# EasyEDA Pro project 电池内阻仪.eprj, board PCB5
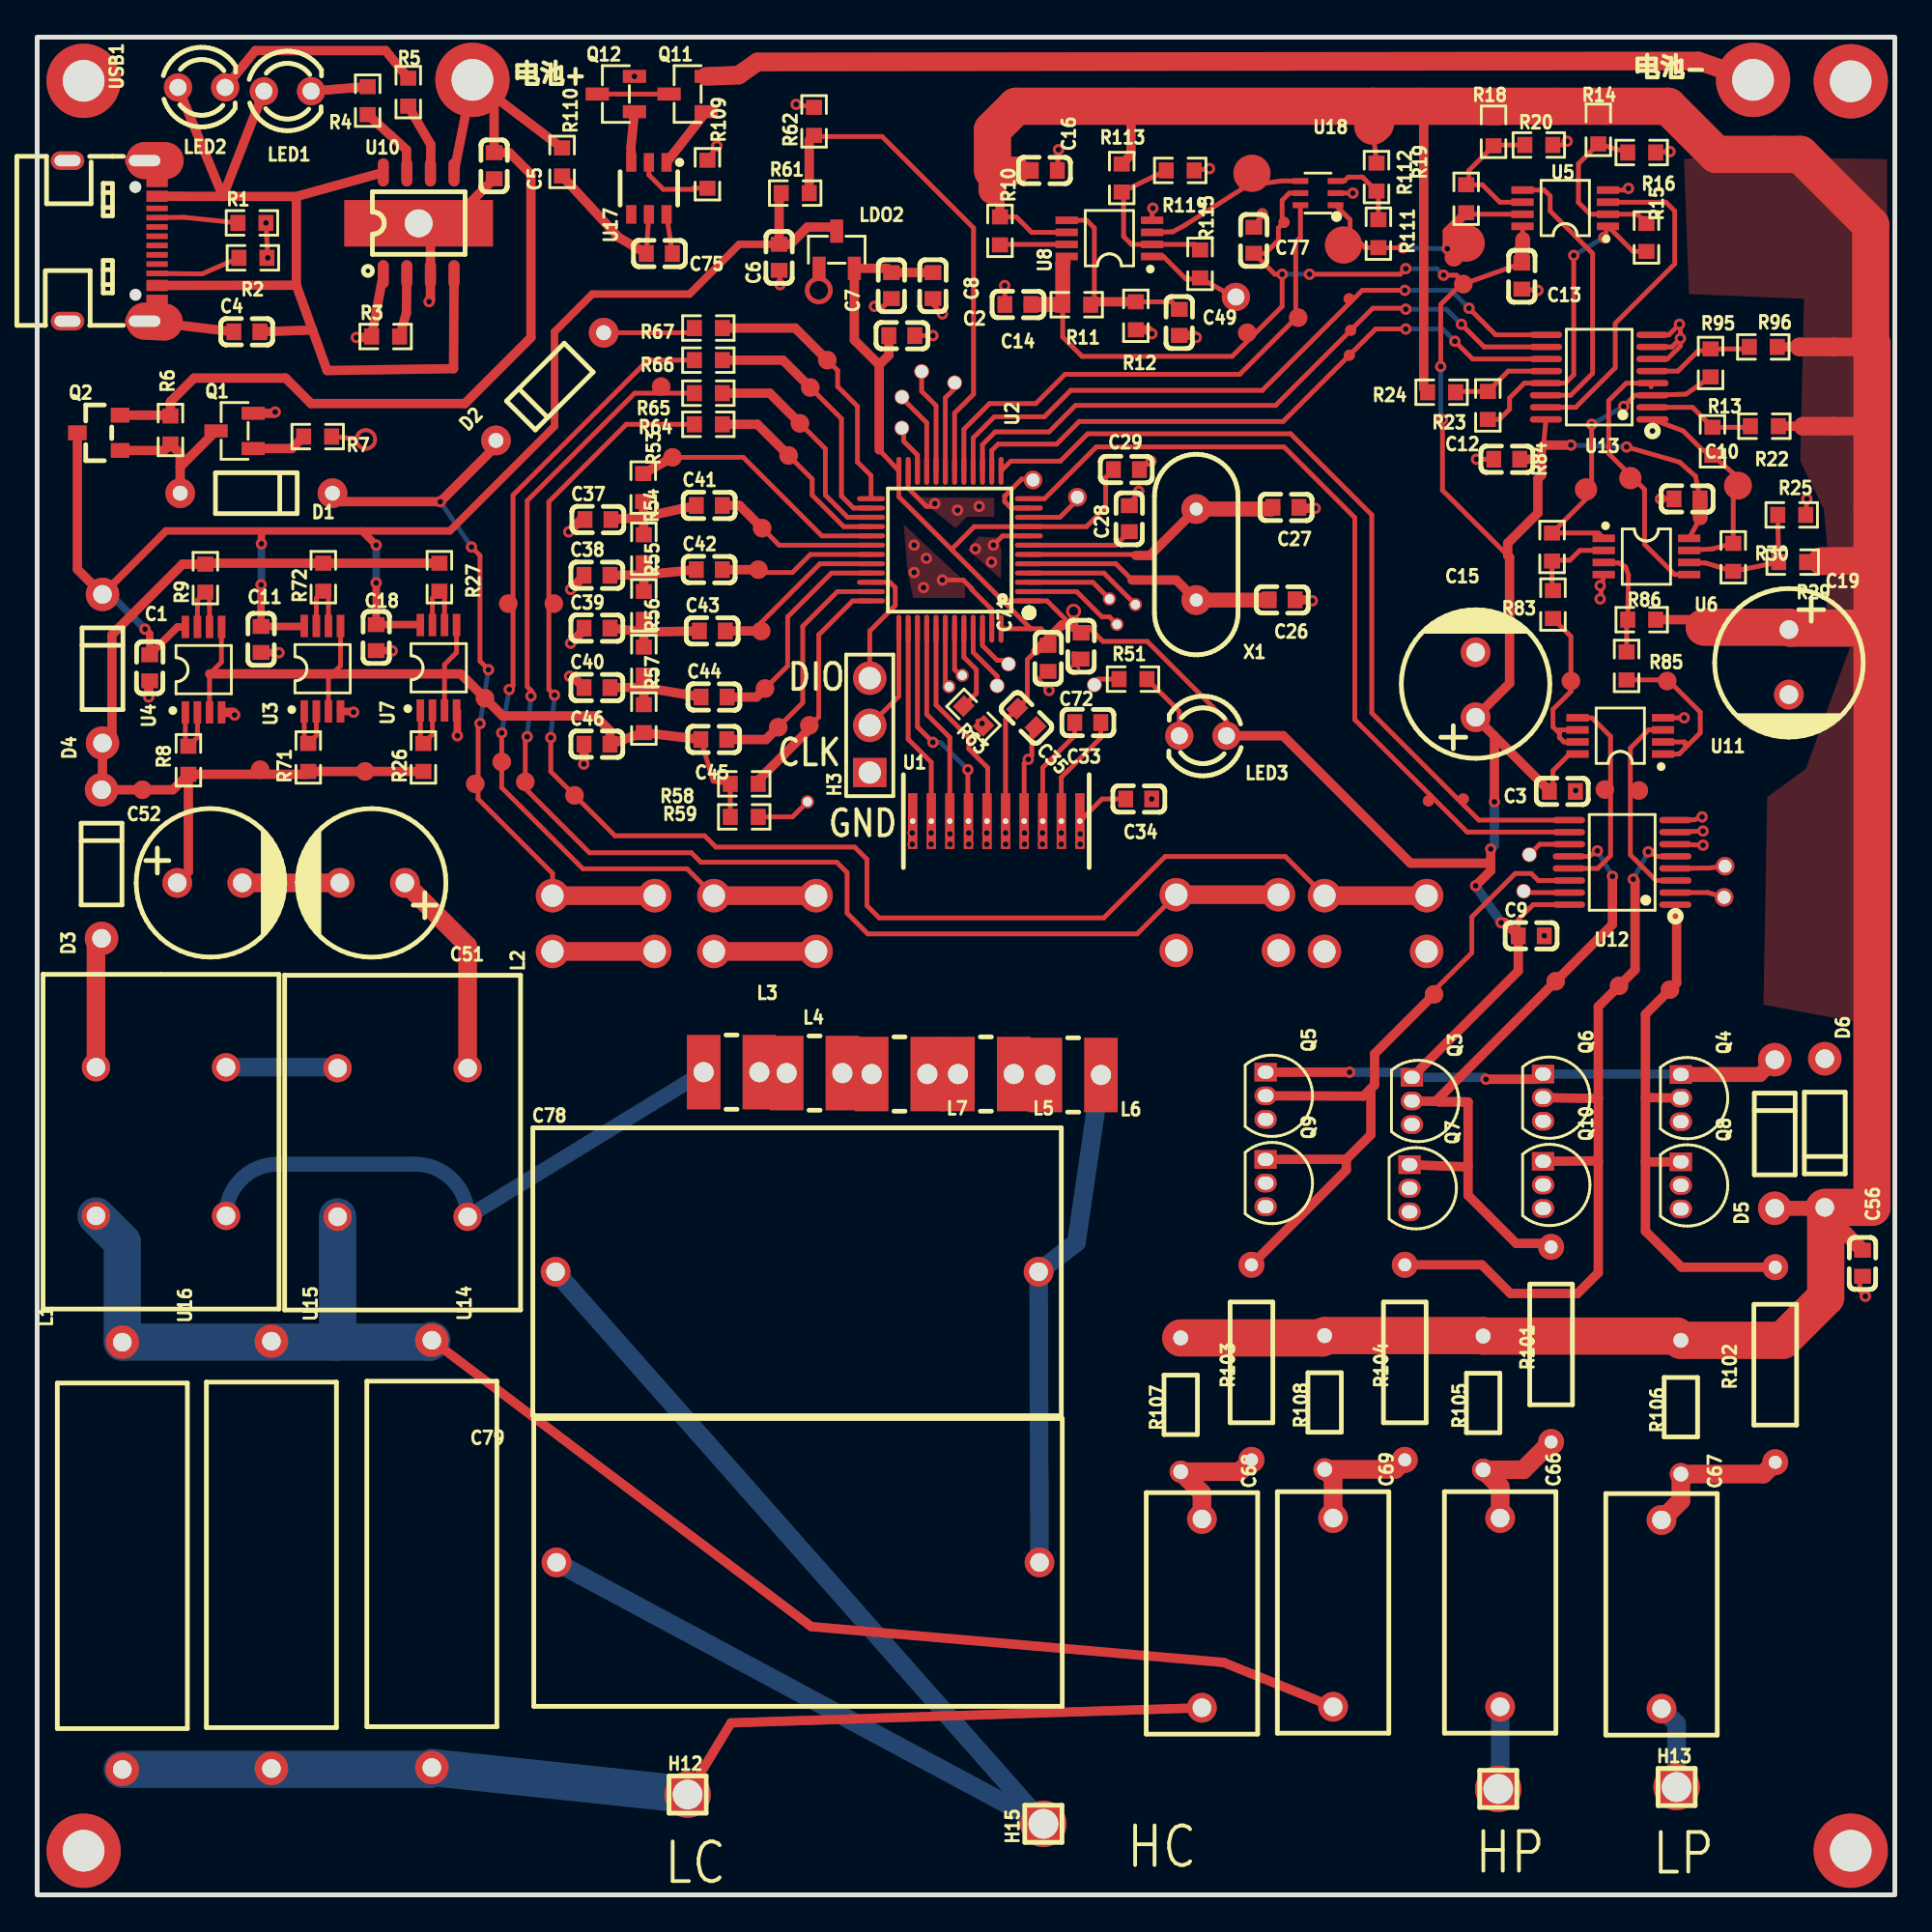
[diagram p1: board, top side]
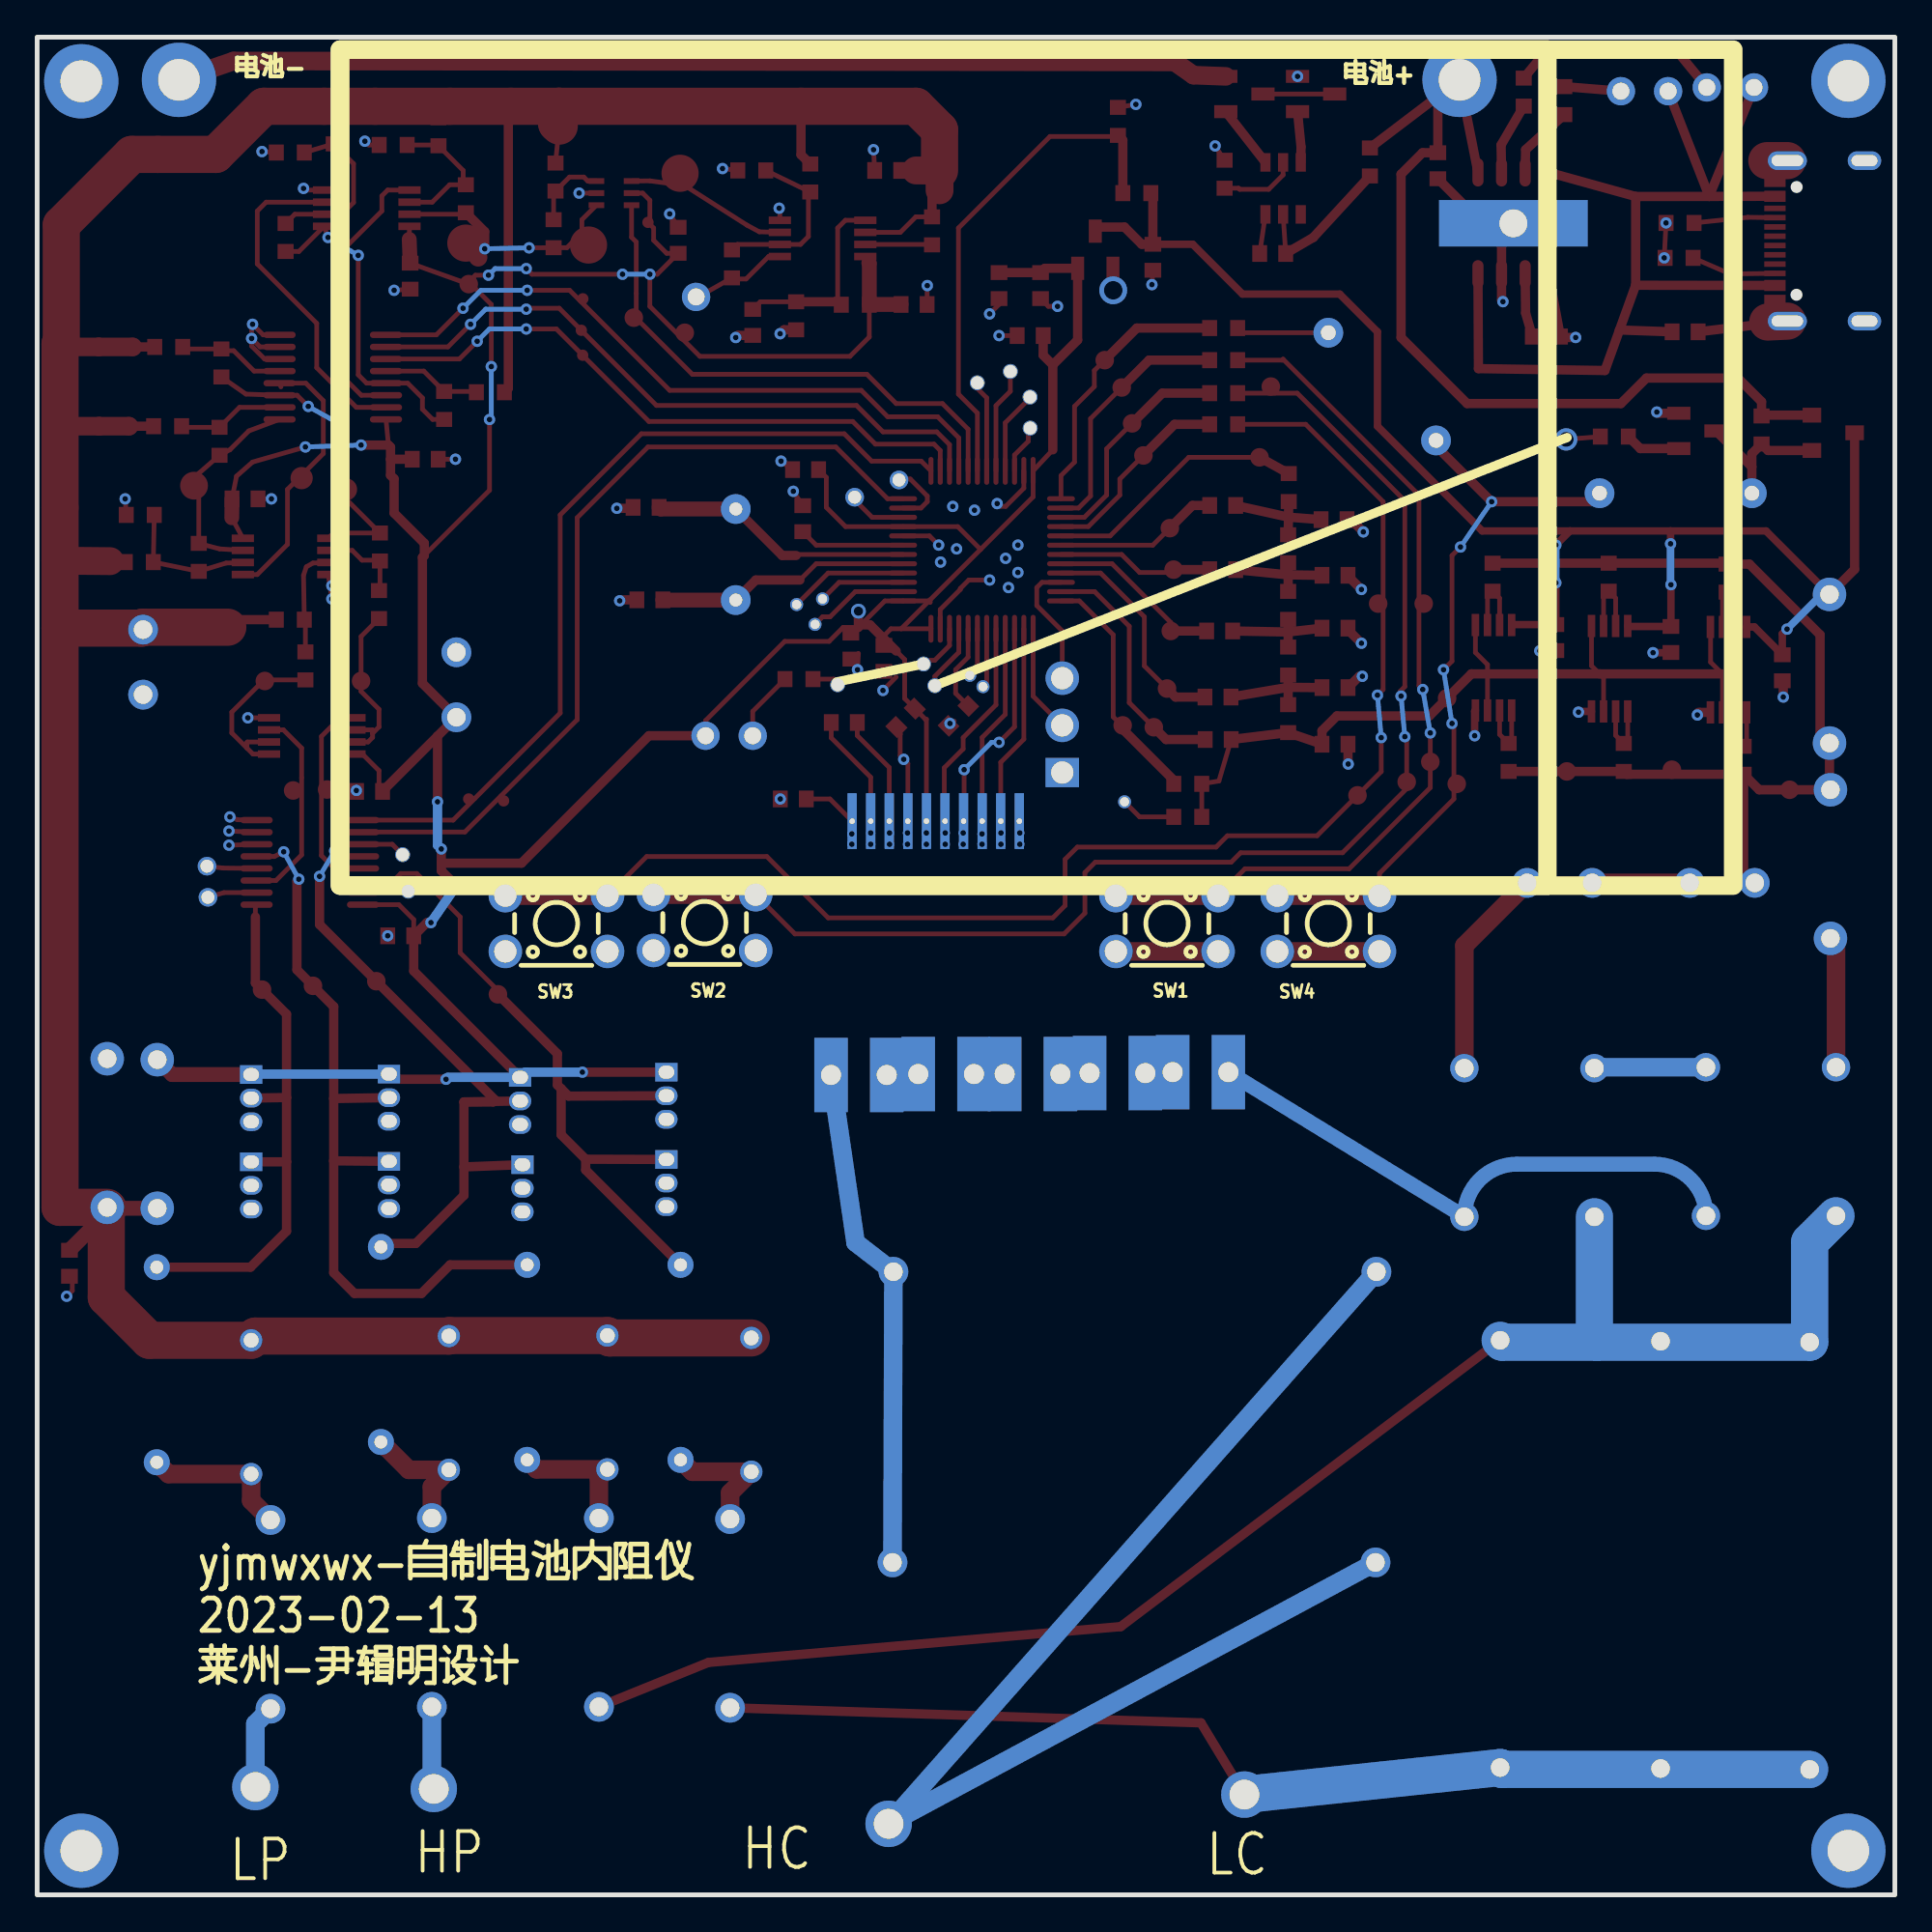
[diagram p2: board, bottom side, seen from below]

Outline 100 x 100 mm; copper layers: Top Layer, Bottom Layer. Coordinates in mm from the lower left corner of the outline.
Outline path: rectangle 0,100 100,0
Stack: Top Layer 0.035mm / Dielectric1 1.51mm FR4 er 4.5 / Bottom Layer 0.035mm

## Design rules (mm)
spacing safeClearance (default): track to track 0.152, other pairs 0.152 to 0.3
track width trackWidth (default): min 0.127, default 0.254, max 2.54
differential pair differentialPair (default): width min 0.127, default 0.254, max 2.54; gap min 0.152, default 0.152
via viaSize (default): diameter min 0.5, default 0.61, max 10; hole min 0.3, default 0.305, max 6

## Placement (name value [footprint] x y rotation side)
C1  100nF  [C0603]  6.06 66.05 270 top
C2  10uF  [C0603]  46.55 83.93 180 top
C3  10uF  [C0603]  82.11 59.4 0 top
C4  10uF  [C0603]  11.29 84.14 0 top
C5  10uF  [C0603]  24.6 93.08 90 top
C6  10uF  [C0603]  39.94 88.15 90 top
C7  100nF  [C0603]  45.99 86.63 90 top
C8  10uF  [C0603]  48.22 86.63 90 top
C9  10uF  [C0603]  80.43 51.63 0 top
C10  10uF  [C0603]  88.81 75.15 180 top
C11  100nF  [C0603]  12.05 67.58 270 top
C12  10uF  [C0603]  79.11 77.28 180 top
C13  10uF  [C0603]  79.92 87.14 90 top
C14  10uF  [C0603]  52.79 85.61 180 top
C15  470uF  [CAP-TH_BD8.0-P3.50-D0.6-FD]  77.43 65.14 90 top
C16  100nF  [C0603]  54.22 92.82 180 top
C18  100nF  [C0603]  18.25 67.68 270 top
C19  470uF  [CAP-TH_BD8.0-P3.50-D0.6-FD]  94.3 66.36 270 top
C26  22pF  [C0603]  67.02 69.71 180 top
C27  22pF  [C0603]  67.22 74.69 180 top
C28  100nF  [C0603]  58.79 74.08 90 top
C29  10uF  [C0603]  58.64 76.72 0 top
C33  100nF  [C0603]  56.55 63.11 180 top
C34  100nF  [C0603]  59.3 58.99 180 top
C35  100nF  [C0603]  53.25 63.36 135 top
C37  100pF  [C0603]  30.19 74.03 0 top
C38  100pF  [C0603]  30.14 71.03 0 top
C39  100pF  [C0603]  30.14 68.19 0 top
C40  100pF  [C0603]  30.14 64.99 0 top
C41  10nF  [C0603]  36.18 74.79 0 top
C42  10nF  [C0603]  36.18 71.34 0 top
C43  10nF  [C0603]  36.35 68.03 0 top
C44  100nF  [C0603]  36.44 64.48 0 top
C45  100nF  [C0603]  36.43 62.19 0 top
C46  100pF  [C0603]  30.14 61.94 0 top
C49  10uF  [C0603]  61.48 84.65 90 top
C51  470uF  [CAP-TH_BD8.0-P3.50-D0.6-FD]  18.04 54.48 180 top
C52  470uF  [CAP-TH_BD8.0-P3.50-D0.6-FD]  9.29 54.48 0 top
C56  10uF  [C0603]  98.26 34 90 top
C66  100nF  [CAP-TH_L13.0-W6.0-P10.00-D1.0]  78.75 15.2 270 top
C67  100nF  [CAP-TH_L13.0-W6.0-P10.00-D1.0]  87.44 15.1 270 top
C68  100nF  [CAP-TH_L13.0-W6.0-P10.00-D1.0]  62.7 15.15 270 top
C69  100nF  [CAP-TH_L13.0-W6.0-P10.00-D1.0]  69.76 15.2 270 top
C71  10uF  [C0603]  54.42 66.56 270 top
C72  10uF  [C0603]  56.2 67.22 90 top
C75  100nF  [C0603]  33.49 88.35 180 top
C77  100nF  [C0603]  65.49 89.06 90 top
C78  4.7uF 630v  [CAP-TH_L28.5-W15.5-P26.0-D0.8]  40.91 33.54 0 top
C79  4.7uF 630v  [CAP-TH_L28.5-W15.5-P26.0-D0.8]  40.96 17.89 0 top
D1  1N4148  [DO-35_BD2.0-L4.2-P8.20-D0.5-RD]  11.8 75.45 180 top
D2  1N4148  [DO-35_BD2.0-L4.2-P8.20-D0.5-RD]  27.6 81.19 45 top
D3  1N4148  [DO-35_BD2.0-L4.0-P8.00-D0.5-FD]  3.47 55.49 90 top
D4  1N4148  [DO-35_BD2.0-L4.0-P8.00-D0.5-FD]  3.52 66 90 top
D5  1N4148  [DO-35_BD2.0-L4.0-P8.00-D0.5-FD]  93.54 40.96 90 top
D6  1N4148  [DO-35_BD2.0-L4.0-P8.00-D0.5-FD]  96.23 41.01 270 top
H3  2.54-1*3P针  [HDR-TH_3P-P2.54-V-M-1]  44.82 62.95 90 top
H12  -  [HDR-TH_1P-V-M_XKB_X4611WV-01I-C28D40]  35.01 5.4 0 top
H13  -  [HDR-TH_1P-V-M_XKB_X4611WV-01I-C28D40]  88.25 5.8 0 top
H14  -  [HDR-TH_1P-V-M_XKB_X4611WV-01I-C28D40]  78.65 5.7 0 top
H15  -  [HDR-TH_1P-V-M_XKB_X4611WV-01I-C28D40]  54.17 3.82 90 top
L1  SLT1212V103MNP  [FILTER-TH_L18.0-W12.5-TL]  6.67 40.55 270 top
L2  SLT1212V103MNP  [FILTER-TH_L18.0-W12.5-TL]  19.67 40.5 270 top
L3  47uH  [IND-SMD_L4.5-W4.0_SLF0403]  37.38 44.29 180 top
L4  47uH  [IND-SMD_L4.5-W4.0_SLF0403]  41.85 44.24 180 top
L5  47uH  [IND-SMD_L4.5-W4.0_SLF0403]  51.07 44.18 180 top
L6  47uH  [IND-SMD_L4.5-W4.0_SLF0403]  55.77 44.13 180 top
L7  47uH  [IND-SMD_L4.5-W4.0_SLF0403]  46.42 44.18 180 top
LDO2  SC662K-3.3V  [SOT-23-3_L2.9-W1.3-P1.90-LS2.4-BR]  43.04 88.56 270 top
LED1  -  [LED-TH_BD3.0-P2.54-FD]  13.47 97.09 0 top
LED2  -  [LED-TH_BD3.0-P2.54-FD]  8.85 97.3 0 top
LED3  -  [LED-TH_BD3.0-P2.54-FD]  62.75 62.39 180 top
NOREF  -  [Pad_e808]  49.8 65.65 0 top
NOREF#2  -  [Pad_e502]  2.5 2.38 0 top
NOREF#3  -  [Pad_e1102]  38.82 71.34 0 top
NOREF#4  -  [Pad_e1118]  34.2 77.38 0 top
NOREF#5  -  [Pad_e3107]  96.69 83.33 0 top
NOREF#6  -  [Pad_e17]  65.39 92.67 0 top
NOREF#7  -  [Pad_e3187]  98.72 74.74 0 top
NOREF#8  -  [Pad_e3132]  93.5 93.69 0 top
NOREF#9  -  [Pad_e2215]  90.81 53.7 0 top
NOREF#10  -  [Pad_e3215]  27.81 69.51 0 top
NOREF#11  -  [Pad_e2214]  90.86 55.37 0 top
NOREF#12  -  [Pad_e719]  76.92 88.91 0 top
NOREF#13  -  [Pad_e3113]  96.66 79.06 0 top
NOREF#14  -  [Pad_e3206]  12 60.57 0 top
NOREF#15  -  [Pad_e853]  41.47 58.84 0 top
NOREF#16  -  [Pad_e3083]  84.39 59.5 0 top
NOREF#17  -  [Pad_e3223]  23.58 59.8 0 top
NOREF#18  -  [Pad_e3173]  81.74 49.18 0 top
NOREF#19  -  [Pad_e503]  97.62 2.38 0 top
NOREF#20  -  [Pad_e3216]  33.59 81.19 0 top
NOREF#21  -  [Pad_e3147]  65.14 84.09 0 top
NOREF#22  -  [Pad_e319]  53.61 76.16 0 top
NOREF#23  -  [Pad_e867]  58.13 68.39 0 top
NOREF#24  -  [Pad_e3101]  94.86 83.33 0 top
NOREF#25  -  [Pad_e3185]  75.2 48.48 0 top
NOREF#26  -  [Pad_e872]  59.12 69.46 0 top
NOREF#27  -  [Pad_e1379]  64.53 86.02 0 top
NOREF#28  -  [Pad_e3224]  25.01 60.99 0 top
NOREF#29  -  [Pad_e3165]  87.74 65.34 0 top
NOREF#30  -  [Pad_e716]  76.26 88.15 0 top
NOREF#31  -  [Pad_e940]  76.77 58.99 0 top
NOREF#32  -  [Pad_e1100]  39.03 73.57 0 top
NOREF#33  -  [Pad_e661]  52.29 66.26 0 top
NOREF#34  -  [Pad_e504]  97.62 97.62 0 top
NOREF#35  -  [Pad_e928]  70.71 84.22 0 top
NOREF#36  -  [Pad_e974]  83.38 75.65 0 top
NOREF#37  -  [Pad_e3207]  17.66 60.47 0 top
NOREF#38  -  [Pad_e1135]  42.53 82.61 0 top
NOREF#39  -  [Pad_e287]  46.55 80.63 0 top
NOREF#40  -  [Pad_e3167]  85.15 48.93 0 top
NOREF#41  -  [Pad_e3146]  67.88 84.9 0 top
NOREF#42  -  [Pad_e498]  2.5 97.65 0 top
NOREF#43  -  [Pad_e1007]  67.12 90.03 0 top
NOREF#44  -  [Pad_e1133]  41.06 79.21 0 top
NOREF#45  -  [Pad_e2256]  70.32 88.81 0 top
NOREF#46  -  [Pad_e3179]  87.9 48.73 0 top
NOREF#47  -  [Pad_e864]  56.91 65.14 0 top
NOREF#48  -  [Pad_e303]  47.61 82 0 top
NOREF#49  -  [Pad_e2625]  17.69 78.35 0 top
NOREF#50  -  [Pad_e3230]  26.28 59.91 0 top
NOREF#51  -  [Pad_e403]  51.68 65.09 0 top
NOREF#52  -  [Pad_e3231]  28.93 59.19 0 top
NOREF#53  -  [Pad_e842]  49.09 65.04 0 top
NOREF#54  -  [Pad_e342]  80.33 55.99 0 top
NOREF#55  -  [Pad_e606]  20.54 89.98 90 top
NOREF#56  -  [Pad_e3194]  24.1 64.42 0 top
NOREF#57  -  [Pad_e271]  46.55 78.96 0 top
NOREF#58  -  [Pad_e637]  23.43 97.7 90 top
NOREF#59  -  [Pad_e3145]  76.77 86.71 0 top
NOREF#60  -  [Pad_e1132]  40.45 77.48 0 top
NOREF#61  -  [Pad_e973]  85.76 76.26 0 top
NOREF#62  -  [Pad_e327]  55.99 75.24 0 top
NOREF#63  -  [Pad_e1104]  39.18 64.94 0 top
NOREF#64  -  [Pad_e868]  57.72 69.76 0 top
NOREF#65  -  [Pad_e946]  74.89 58.89 0 top
NOREF#66  -  [Pad_e3119]  95.06 79.06 0 top
NOREF#67  -  [Pad_e1112]  41.57 62.95 0 top
NOREF#68  -  [Pad_e395]  80.02 54.03 0 top
NOREF#69  -  [Pad_e934]  70.63 82.88 0 top
NOREF#70  -  [Pad_e1108]  39.89 62.85 0 top
NOREF#71  -  [Pad_e3131]  91.7 93.4 0 top
NOREF#72  -  [Pad_e3097]  82.56 65.34 0 top
NOREF#73  -  [Pad_e3089]  86.22 59.45 0 top
NOREF#74  -  [Pad_e927]  70.62 85.92 0 top
NOREF#75  -  [Pad_e1134]  41.62 81.14 0 top
NOREF#76  -  [Pad_e1733]  55.79 69.1 0 top
NOREF#77  -  [Pad_e963]  91.55 75.86 0 top
NOREF#78  -  [Pad_e3159]  89.74 68.24 0 top
NOREF#79  -  [Pad_e1103]  38.98 68.03 0 top
NOREF#80  -  [Pad_e309]  49.39 81.39 0 top
NOREF#81  -  [Pad_e643]  92.37 97.7 90 top
NOREF#82  -  [Pad_e3200]  5.67 59.49 0 top
NOREF#83  -  [Pad_e3214]  25.36 69.51 0 top
Q1  AO3400A  [SOT-23-3_L2.9-W1.3-P1.90-LS2.4-BR]  10.63 78.8 0 top
Q2  AO3401A  [SOT-23_L2.9-W1.3-P1.90-LS2.4-BR]  3.31 78.7 0 top
Q3  BC547  [TO-92-3_L4.5-W3.5-P1.27-L]  74 42.74 270 top
Q4  BC547  [TO-92-3_L4.5-W3.5-P1.27-L]  88.48 42.89 270 top
Q5  BC547  [TO-92-3_L4.5-W3.5-P1.27-L]  66.13 43.02 270 top
Q6  BC547  [TO-92-3_L4.5-W3.5-P1.27-L]  81.06 42.91 270 top
Q7  BC547  [TO-92-3_L4.5-W3.5-P1.27-L]  73.88 38.04 270 top
Q8  BC547  [TO-92-3_L4.5-W3.5-P1.27-L]  88.48 38.19 270 top
Q9  BC547  [TO-92-3_L4.5-W3.5-P1.27-L]  66.13 38.32 270 top
Q10  BC547  [TO-92-3_L4.5-W3.5-P1.27-L]  81.06 38.21 270 top
Q11  AO3400A  [SOT-23-3_L2.9-W1.3-P1.90-LS2.4-BR]  35.01 96.94 0 top
Q12  AO3400A  [SOT-23-3_L2.9-W1.3-P1.90-LS2.4-BR]  31.15 96.94 0 top
R1  10K  [R0603]  11.56 90 0 top
R2  10K  [R0603]  11.61 88.12 180 top
R3  1.3K  [R0603]  18.76 83.88 0 top
R4  1K  [R0603]  17.79 96.58 90 top
R5  1K  [R0603]  19.98 97.04 90 top
R6  10K  [R0603]  7.18 78.85 90 top
R7  10K  [R0603]  15.1 78.5 180 top
R8  1Ω  [R0603]  8.14 61.07 90 top
R9  1Ω  [R0603]  9.06 70.88 90 top
R10  10  [R0603]  51.83 89.57 270 top
R11  10K  [R0603]  55.96 85.6 180 top
R12  10K  [R0603]  59.14 85 90 top
R13  9K  [R0603]  90.18 78.25 270 top
R14  100  [R0603]  84.04 95.01 270 top
R15  900  [R0603]  86.63 89.22 270 top
R16  100kΩ  [R0603]  86.37 93.79 180 top
R18  100  [R0603]  78.4 94.91 270 top
R19  900  [R0603]  76.92 91.3 270 top
R20  83.3K  [R0603]  80.84 94.2 0 top
R22  1K  [R0603]  92.98 79.06 180 top
R23  9K  [R0603]  78.09 80.17 270 top
R24  1K  [R0603]  75.6 80.89 0 top
R25  83.3K  [R0603]  94.45 74.28 180 top
R26  1Ω  [R0603]  20.79 61.23 90 top
R27  1Ω  [R0603]  21.65 70.93 90 top
R29  100  [R0603]  94.5 71.74 180 top
R30  900  [R0603]  91.3 72 270 top
R51  1K  [R0603]  58.99 65.44 180 top
R53  1K  [R0603]  32.63 75.76 270 top
R54  1K  [R0603]  32.66 72.46 270 top
R55  1K  [R0603]  32.66 69.41 270 top
R56  1K  [R0603]  32.66 66.42 270 top
R57  1K  [R0603]  32.66 63.32 270 top
R58  10K  [R0603]  38.06 59.8 0 top
R59  10K  [R0603]  38.06 58.03 0 top
R61  10K  [R0603]  40.81 91.61 0 top
R62  10K  [R0603]  41.82 95.47 90 top
R63  10K  [R0603]  50.41 63.46 135 top
R64  10K  [R0603]  36.13 79.16 0 top
R65  10K  [R0603]  36.13 80.84 0 top
R66  10K  [R0603]  36.13 82.61 0 top
R67  10K  [R0603]  36.13 84.34 0 top
R71  1Ω  [R0603]  14.59 61.23 90 top
R72  1Ω  [R0603]  15.41 70.93 90 top
R83  10K  [R0603]  81.6 69.46 90 top
R84  10K  [R0603]  81.55 72.56 90 top
R85  10K  [R0603]  85.56 66.15 90 top
R86  10K  [R0603]  86.37 68.64 0 top
R95  9K  [R0603]  90.08 82.46 270 top
R96  1K  [R0603]  92.92 83.33 180 top
R101  10kΩ  [RES-TH_BD2.3-L6.5-P10.50-D0.5]  81.5 29.63 90 top
R102  10kΩ  [RES-TH_BD2.3-L6.5-P10.50-D0.5]  93.56 28.54 90 top
R103  10kΩ  [RES-TH_BD2.3-L6.5-P10.50-D0.5]  65.37 28.66 90 top
R104  10kΩ  [RES-TH_BD2.3-L6.5-P10.50-D0.5]  73.62 28.66 90 top
R105  100K  [RES-TH_BD1.8-L3.2-P7.20-D0.4]  77.84 26.48 90 top
R106  100K  [RES-TH_BD1.8-L3.2-P7.20-D0.4]  88.48 26.25 90 top
R107  1MΩ  [RES-TH_BD1.8-L3.2-P7.20-D0.4]  61.56 26.38 90 top
R108  1MΩ  [RES-TH_BD1.8-L3.2-P7.20-D0.4]  69.3 26.5 90 top
R109  1K  [R0603]  36.08 92.62 270 top
R110  100K  [R0603]  28.26 93.28 270 top
R111  10K  [R0603]  72.2 89.42 90 top
R112  10K  [R0603]  72.1 92.47 90 top
R113  10K  [R0603]  58.38 92.42 270 top
R115  10K  [R0603]  62.6 87.8 270 top
R119  33K  [R0603]  61.53 92.82 180 top
SW1  TC-1109-C-B  [KEY-TH_4P-L4.5-W4.5-P3.00-LS5.8]  39.18 52.29 180 bottom
SW2  TC-1109-C-B  [KEY-TH_4P-L4.5-W4.5-P3.00-LS5.8]  64.07 52.34 180 bottom
SW3  TC-1109-C-B  [KEY-TH_4P-L4.5-W4.5-P3.00-LS5.8]  72.05 52.29 180 bottom
SW4  TC-1109-C-B  [KEY-TH_4P-L4.5-W4.5-P3.00-LS5.8]  30.49 52.29 180 bottom
U1  -  [FPC10]  50.63 57.8 0 top
U2  N32G430C8L7  [LQFP-48_L7.0-W7.0-P0.50-LS9.0-BL]  49.14 72.4 90 top
U3  COS722MR  [MSOP-8_L3.0-W3.0-P0.65-LS4.9-BL-1]  15.35 66 0 top
U4  COS722MR  [MSOP-8_L3.0-W3.0-P0.65-LS4.9-BL-1]  8.95 65.95 0 top
U5  COS722MR  [MSOP-8_L3.0-W3.0-P0.65-LS4.9-BL-1]  82.26 90.79 90 top
U6  SGM3157  [MSOP-8_L3.0-W3.0-P0.65-LS4.9-BL-1]  86.63 72.05 270 top
U7  COS722MR  [MSOP-8_L3.0-W3.0-P0.65-LS4.9-BL-1]  21.6 66.05 0 top
U8  COS722MR  [MSOP-8_L3.0-W3.0-P0.65-LS4.9-BL-1]  57.72 89.17 90 top
U10  WSP4056  [SOP-8_L5.1-W3.9-P1.27-LS6.0-BL]  20.54 89.98 0 top
U11  COS722MR  [MSOP-8_L3.0-W3.0-P0.65-LS4.9-BL-1]  85.22 62.38 90 top
U12  COS722MR  [TSSOP-16_L5.0-W4.4-P0.65-LS6.4-BL]  85.32 55.58 90 top
U13  RS2253XTSS16  [TSSOP-16_L5.0-W4.4-P0.65-LS6.4-BL]  84.09 81.7 90 top
U14  10Ω  [RES-TH_BD6.0-L17.5-P21.50-D0.8]  21.25 18.35 270 top
U15  10Ω  [RES-TH_BD6.0-L17.5-P21.50-D0.8]  12.61 18.3 270 top
U16  10Ω  [RES-TH_BD6.0-L17.5-P21.50-D0.8]  4.58 18.25 270 top
U17  WSTDW01  [SOT-23-6_L2.9-W1.6-P0.95-LS2.8-BR]  32.93 91.86 90 top
U18  SGM3157  [SC-70-6_L2.2-W1.3-P0.65-LS2.2-BR]  68.95 91.61 0 top
USB1  TYPEC-304-ACP16  [USB-C-SMD_TYPE-C-16P-1]  4.05 89.03 270 top
X1  8MHz  [OSC-TH_L10.0-W4.5-P5.00]  62.4 72.15 180 top

## Footprints (pads in the part's own frame, mm; a bottom-side part is the same pattern mirrored in y, then rotated)
C0603
  rect 0.8x0.9 smd: 1(-0.7,0) 2(0.7,0)
CAP-TH_BD8.0-P3.50-D0.6-FD
  round 1.6 hole 1: 1(-1.75,0) 2(1.75,0)
CAP-TH_L13.0-W6.0-P10.00-D1.0
  round 1.6 hole 1: 1(-5.08,0) 2(5.08,0)
CAP-TH_L28.5-W15.5-P26.0-D0.8
  round 1.6 hole 1: 1(-13,0) 2(13,0)
DO-35_BD2.0-L4.0-P8.00-D0.5-FD
  round 1.801 hole 1.001: 1(-4,0) 2(4,0)
DO-35_BD2.0-L4.2-P8.20-D0.5-RD
  round 1.6 hole 0.8: 1(-4.099,0) 2(4.099,0)
FILTER-TH_L18.0-W12.5-TL
  round 1.524 hole 1: 1(-4,-3.5) 2(4,-3.5) 3(4,3.5) 4(-4,3.5)
FPC10
  rect 0.5x3 hole 0.3: 1(-3.5,0) 2(-2.5,0) 3(-1.5,0) 4(-0.5,0) 5(0.5,0) 6(1.5,0) 7(2.5,0) 8(3.5,0) 9(4.5,0) 10(5.5,0)
HDR-TH_1P-V-M_XKB_X4611WV-01I-C28D40
  round 2.5 hole 1.6: 1(0,0)
HDR-TH_3P-P2.54-V-M-1
  rect 1.575x1.801 hole 1.199: 1(-2.54,0)
  round 1.801 hole 1.199: 2(0,0) 3(2.54,0)
IND-SMD_L4.5-W4.0_SLF0403
  rect 1.801x4 hole 1.081: 1(-1.498,0) 2(1.501,0)
KEY-TH_4P-L4.5-W4.5-P3.00-LS5.8
  round 1.801 hole 1.199: 1(-2.751,1.501) 2(2.751,1.501) 3(-2.751,-1.501) 4(2.751,-1.501)
LED-TH_BD3.0-P2.54-FD
  round 1.524 hole 0.914: 1(-1.27,0) 2(1.27,0)
LQFP-48_L7.0-W7.0-P0.50-LS9.0-BL
  oval 0.27x1.5 smd: 1(-2.75,-4.25) 2(-2.25,-4.25) 3(-1.75,-4.25) 4(-1.25,-4.25) 5(-0.75,-4.25) 6(-0.25,-4.25) 7(0.25,-4.25) 8(0.75,-4.25) 9(1.25,-4.25) 10(1.75,-4.25) 11(2.25,-4.25) 12(2.75,-4.25) 25(2.75,4.25) 26(2.25,4.25) 27(1.75,4.25) 28(1.25,4.25) 29(0.75,4.25) 30(0.25,4.25) 31(-0.25,4.25) 32(-0.75,4.25) 33(-1.25,4.25) 34(-1.75,4.25) 35(-2.25,4.25) 36(-2.75,4.25)
  oval 1.5x0.27 smd: 13(4.25,-2.75) 14(4.25,-2.25) 15(4.25,-1.75) 16(4.25,-1.25) 17(4.25,-0.75) 18(4.25,-0.25) 19(4.25,0.25) 20(4.25,0.75) 21(4.25,1.25) 22(4.25,1.75) 23(4.25,2.25) 24(4.25,2.75) 37(-4.25,2.75) 38(-4.25,2.25) 39(-4.25,1.75) 40(-4.25,1.25) 41(-4.25,0.75) 42(-4.25,0.25) 43(-4.25,-0.25) 44(-4.25,-0.75) 45(-4.25,-1.25) 46(-4.25,-1.75) 47(-4.25,-2.25) 48(-4.25,-2.75)
MSOP-8_L3.0-W3.0-P0.65-LS4.9-BL-1
  rect 0.406x1.199 smd: 1(-0.976,-2.299) 2(-0.325,-2.299) 3(0.325,-2.299) 4(0.976,-2.299) 5(0.976,2.301) 6(0.325,2.301) 7(-0.325,2.301) 8(-0.976,2.301)
OSC-TH_L10.0-W4.5-P5.00
  round 1.6 hole 0.701: 1(0,2.451) 2(0,-2.451)
Pad_e17
  round 2 smd: TP2(0,0)
Pad_e271
  round 0.8 hole 0.7: 1(0,0)
Pad_e287
  round 0.8 hole 0.7: 2(0,0)
Pad_e303
  round 0.8 hole 0.7: 3(0,0)
Pad_e309
  round 0.8 hole 0.7: 4(0,0)
Pad_e319
  round 1 hole 0.7: 5(0,0)
Pad_e327
  round 1 hole 0.7: 6(0,0)
Pad_e342
  round 0.8 hole 0.7: 9(0,0)
Pad_e395
  round 0.8 hole 0.7: 10(0,0)
Pad_e403
  round 0.8 hole 0.7: 11(0,0)
Pad_e498
  round 4 hole 2.24: 1(0,0)
Pad_e502
  round 4 hole 2.24: 1(0,0)
Pad_e503
  round 4 hole 2.24: 1(0,0)
Pad_e504
  round 4 hole 2.24: 1(0,0)
Pad_e606
  rect 2.5x8 hole 1.5: 1(0,0)
Pad_e637
  round 4 hole 2.24: 1(0,0)
Pad_e643
  round 4 hole 2.24: 1(0,0)
Pad_e661
  round 0.8 hole 0.7: 12(0,0)
Pad_e716
  round 1 smd: TP5(0,0)
Pad_e719
  round 2 smd: TP6(0,0)
Pad_e808
  round 0.7 hole 0.5: 13(0,0)
Pad_e842
  round 0.7 hole 0.5: 14(0,0)
Pad_e853
  round 0.7 hole 0.5: 15(0,0)
Pad_e864
  round 0.8 hole 0.7: 12(0,0)
Pad_e867
  round 0.7 hole 0.5: 16(0,0)
Pad_e868
  round 0.7 hole 0.5: 17(0,0)
Pad_e872
  round 0.7 hole 0.5: 18(0,0)
Pad_e927
  round 0.61 smd: TP2(0,0)
Pad_e928
  round 0.61 smd: TP3(0,0)
Pad_e934
  round 0.61 smd: TP4(0,0)
Pad_e940
  round 0.61 smd: TP5(0,0)
Pad_e946
  round 0.61 smd: TP6(0,0)
Pad_e963
  round 1.5 smd: TP1(0,0)
Pad_e973
  round 1.2 smd: TP3(0,0)
Pad_e974
  round 1.2 smd: TP4(0,0)
Pad_e1007
  round 0.61 smd: TP14(0,0)
Pad_e1100
  round 1 smd: TP8(0,0)
Pad_e1102
  round 1 smd: TP9(0,0)
Pad_e1103
  round 1 smd: TP10(0,0)
Pad_e1104
  round 1 smd: TP11(0,0)
Pad_e1108
  round 1 smd: TP12(0,0)
Pad_e1112
  round 1 smd: TP15(0,0)
Pad_e1118
  round 1 smd: TP17(0,0)
Pad_e1132
  round 1 smd: TP19(0,0)
Pad_e1133
  round 1 smd: TP20(0,0)
Pad_e1134
  round 1 smd: TP21(0,0)
Pad_e1135
  round 1 smd: TP22(0,0)
Pad_e1379
  round 1.524 hole 0.914: 1(0,0)
Pad_e1733
  round 0.61 smd: TP23(0,0)
Pad_e2214
  round 1 hole 0.7: 1(0,0)
Pad_e2215
  round 1 hole 0.7: 2(0,0)
Pad_e2256
  round 2 smd: TP6(0,0)
Pad_e2625
  round 1.2 smd: TP1(0,0)
Pad_e3083
  round 1 smd: TP15(0,0)
Pad_e3089
  round 1 smd: TP16(0,0)
Pad_e3097
  round 1 smd: TP19(0,0)
Pad_e3101
  round 1 smd: TP23(0,0)
Pad_e3107
  round 1 smd: TP24(0,0)
Pad_e3113
  round 1 smd: TP25(0,0)
Pad_e3119
  round 1 smd: TP26(0,0)
Pad_e3131
  round 1 smd: TP28(0,0)
Pad_e3132
  round 1 smd: TP29(0,0)
Pad_e3145
  round 1 smd: TP32(0,0)
Pad_e3146
  round 1 smd: TP33(0,0)
Pad_e3147
  round 1 smd: TP34(0,0)
Pad_e3159
  round 1 smd: TP41(0,0)
Pad_e3165
  round 1 smd: TP42(0,0)
Pad_e3167
  round 1 smd: TP44(0,0)
Pad_e3173
  round 1 smd: TP45(0,0)
Pad_e3179
  round 1 smd: TP46(0,0)
Pad_e3185
  round 1 smd: TP47(0,0)
Pad_e3187
  round 1 smd: TP49(0,0)
Pad_e3194
  round 1 smd: TP51(0,0)
Pad_e3200
  round 1 smd: TP52(0,0)
Pad_e3206
  round 1 smd: TP53(0,0)
Pad_e3207
  round 1 smd: TP54(0,0)
Pad_e3214
  round 1 smd: TP56(0,0)
Pad_e3215
  round 1 smd: TP57(0,0)
Pad_e3216
  round 1 smd: TP58(0,0)
Pad_e3223
  round 1 smd: TP60(0,0)
Pad_e3224
  round 1 smd: TP61(0,0)
Pad_e3230
  round 1 smd: TP62(0,0)
Pad_e3231
  round 1 smd: TP63(0,0)
R0603
  rect 0.806x0.864 smd: 1(-0.753,0) 2(0.753,0)
RES-TH_BD1.8-L3.2-P7.20-D0.4
  round 1.2 hole 0.8: 1(-3.6,0) 2(3.6,0)
RES-TH_BD2.3-L6.5-P10.50-D0.5
  round 1.4 hole 0.7: 1(-5.25,0) 2(5.25,0)
RES-TH_BD6.0-L17.5-P21.50-D0.8
  round 1.8 hole 1: 1(-11.5,0) 2(11.5,0)
SC-70-6_L2.2-W1.3-P0.65-LS2.2-BR
  rect 0.841x0.315 smd: 1(0.946,-0.65) 2(0.946,0) 3(0.946,0.65) 4(-0.946,0.65) 5(-0.946,0) 6(-0.946,-0.65)
SOP-8_L5.1-W3.9-P1.27-LS6.0-BL
  oval 0.6x1.519 smd: 1(-1.905,-2.74) 2(-0.635,-2.74) 3(0.635,-2.74) 4(1.905,-2.74) 5(1.905,2.74) 6(0.635,2.74) 7(-0.635,2.74) 8(-1.905,2.74)
SOT-23-3_L2.9-W1.3-P1.90-LS2.4-BR
  rect 1.25x0.7 smd: 1(1,-0.95) 2(1,0.95) 3(-1,0)
SOT-23-6_L2.9-W1.6-P0.95-LS2.8-BR
  rect 1x0.55 smd: 1(1.4,-0.95) 2(1.4,0) 3(1.4,0.95) 4(-1.4,0.95) 5(-1.4,0) 6(-1.4,-0.95)
SOT-23_L2.9-W1.3-P1.90-LS2.4-BR
  rect 1x0.8 smd: 1(1.15,-0.95) 2(1.15,0.95) 3(-1.15,0)
TO-92-3_L4.5-W3.5-P1.27-L
  rect 1x1.2 hole 0.7x0.85: 1(-1.27,0)
  oval 1x1.2 hole 0.7x0.85: 2(0,0) 3(1.27,0)
TSSOP-16_L5.0-W4.4-P0.65-LS6.4-BL
  oval 0.343x1.732 smd: 1(-2.276,-2.865) 2(-1.625,-2.865) 3(-0.976,-2.865) 4(-0.325,-2.865) 5(0.325,-2.865) 6(0.976,-2.865) 7(1.625,-2.865) 8(2.276,-2.865) 9(2.276,2.865) 10(1.625,2.865) 11(0.976,2.865) 12(0.325,2.865) 13(-0.325,2.865) 14(-0.976,2.865) 15(-1.625,2.865) 16(-2.276,2.865)
USB-C-SMD_TYPE-C-16P-1
  rect 0.6x1.15 smd: A1B12(-3.2,2.41) A4B9(-2.4,2.41) B1A12(3.2,2.41) B4A9(2.4,2.41)
  rect 0.3x1.15 smd: A5(-1.25,2.41) A6(-0.25,2.41) A7(0.25,2.41) A8(1.25,2.41) B5(1.75,2.41) B6(0.75,2.41) B7(-0.75,2.41) B8(-1.75,2.41)
  oval 1x2.1 hole 0.6x1.7: EP(-4.32,1.74) EP(4.32,1.74)
  oval 1x1.8 hole 0.6x1.4: EP(-4.32,-2.41) EP(4.32,-2.41)

## Nets
+1.65V: C16.2 C19.1 C56.2 D5.1 D6.2 NOREF#5.TP24 NOREF#7.TP49 NOREF#8.TP29 NOREF#13.TP25 NOREF#24.TP23 NOREF#66.TP26 NOREF#71.TP28 NOREF#78.TP41 R10.1 R14.1 R18.1 R22.1 R24.1 R29.1 R86.2 R96.1 R105.2 R106.2 R107.2 R108.2 R112.2 R113.1 U8.6
+3.3V: C2.2 C3.1 C7.2 C8.2 C9.1 C10.1 C12.1 C13.2 C14.1 C15.1 C29.1 C35.2 C71.1 C72.2 C77.1 D5.2 LDO2.2 LED3.1 NOREF#21.TP34 NOREF#43.TP14 NOREF#59.TP32 NOREF#76.TP23 Q3.1 Q4.1 Q5.1 Q6.1 R11.2 U1.6 U2.1 U2.9 U2.24 U2.48 U5.8 U6.8 U8.8 U11.8 U12.16 U13.16 U18.5
GND: C1.2 C2.1 C3.2 C4.1 C5.1 C6.1 C7.1 C8.1 C9.2 C10.2 C11.2 C12.2 C13.1 C14.2 C15.2 C16.1 C18.2 C19.2 C26.1 C27.1 C28.2 C29.2 C34.1 C35.1 C37.1 C38.1 C39.1 C40.1 C46.1 C49.1 C56.1 C71.2 C72.1 C77.2 D3.1 D6.1 H3.1 L1.1 LDO2.1 NOREF#2.1 NOREF#19.1 NOREF#34.1 NOREF#42.1 NOREF#55.1 Q1.2 Q7.2 Q8.2 Q9.2 Q10.2 Q12.2 R1.2 R2.1 R3.1 R12.1 R16.1 R20.2 R25.1 R62.2 R63.1 R109.1 R119.1 SW1.3 SW1.4 SW2.3 SW2.4 SW3.3 SW3.4 SW4.3 SW4.4 U1.1 U1.7 U2.8 U2.23 U2.47 U3.4 U4.4 U5.4 U6.4 U7.4 U8.4 U10.1 U10.3 U11.4 U12.6 U12.7 U12.8 U13.6 U13.7 U13.8 U18.2 USB1.A1B12 USB1.B1A12 USB1.EP
VCC: C4.2 LED1.1 LED2.1 U10.4 U10.8 USB1.A4B9 USB1.B4A9
VDD: C1.1 C6.2 C11.1 C18.1 D4.2 LDO2.3 Q2.3 R61.1 U3.8 U4.8 U7.8
BT+: C5.2 NOREF#58.1 Q2.2 R6.2 R110.1 U10.5
BT-: NOREF#81.1 Q11.2
BT_DIANYA: R61.2 R62.1 U2.18
HC: C78.1 C79.1 H15.1
HP: C66.2 H14.1
LC: C68.2 H12.1 U14.2 U15.2 U16.2
LP: C67.2 H13.1
PA0_ADC: NOREF#27.1 NOREF#62.6 R115.2 U2.10 U8.1
PA2_4052_S0_10: NOREF#65.TP6 U2.12 U12.10
PA3_4052_S1_9: NOREF#31.TP5 U2.13 U12.9
PA4_RS2253_C: NOREF#69.TP4 U2.14 U13.11
PA5_RS2253_B: NOREF#35.TP3 U2.15 U13.10
PA6_RS2253_A: NOREF#74.TP2 U2.16 U13.9
PA7_SMG3175: NOREF#41.TP33 U2.17 U18.6
PA13_SWDIO: H3.3 U2.34
PA14_SWCLK: H3.2 U2.37
PA15_RST: U1.2 U2.38
PB3_SPI1_SCK: U1.4 U2.39
PB4_RS: U1.3 U2.40
PB5_SPI1_MOSI: U1.5 U2.41
PB8_GUANJI: NOREF#49.TP1 NOREF#51.11 R7.1 U2.45
PB9_LCD_BEIGUANG: NOREF#33.12 NOREF#47.12 R51.2 U2.46
PB12_KAIJI: D2.2 R67.1
SIN: C45.1 C46.2 NOREF#56.TP51 R57.2 R58.1 R59.1 U3.3 U3.5 U4.3 U4.5 U7.3 U7.5
$1N5478: R1.1 USB1.A5
$1N5501: R2.2 USB1.B5
$1N5982: R3.2 U10.2
$1N6392: LED1.2 R4.2
$1N6468: LED2.2 R5.2
$1N6485: R4.1 U10.7
$1N7176: R5.1 U10.6
$1N9972: D1.2 Q1.3 Q2.1 R6.1
$1N10161: Q1.1 R7.2
$1N32954: R83.2 R84.1 U6.2
$1N33172: NOREF#72.TP19 R83.1 U11.6 U11.7
$1N55108: C26.2 U2.5 X1.1
$1N55316: C27.2 U2.6 X1.2
$1N56684: C28.1 U2.7
$1N65263: C33.2 U1.8
$1N65484: C33.1 U1.9
$1N65778: C34.2 U1.10
$1N76678: LED3.2 R51.1
$1N79731: NOREF#4.TP17 R53.1 U2.29
$1N83028: C38.2 C42.1 R54.2 R55.1
$1N83269: C39.2 C43.1 R55.2 R56.1
$1N83512: C40.2 C44.1 R56.2 R57.1
$1N86336: C41.2 NOREF#32.TP8 U2.30
$1N86592: C42.2 NOREF#3.TP9 U2.31
$1N86848: C43.2 NOREF#79.TP10 U2.32
$1N87104: C44.2 NOREF#63.TP11 U2.33
$1N87360: C45.2 NOREF#70.TP12 U2.35
$1N88068: NOREF#67.TP15 R58.2 U2.36
$1N90333: NOREF#15.15 NOREF#53.14 R59.2 U2.42
$1N104798: R63.2 U2.44
$1N112001: NOREF#38.TP22 R67.2 U2.25
$1N112276: NOREF#75.TP21 R66.2 U2.26
$1N112550: NOREF#44.TP20 R65.2 U2.27
$1N112826: NOREF#60.TP19 R64.2 U2.28
$1N150454: D1.1 D2.1 NOREF#17.TP60 SW4.1 SW4.2
$1N155250: NOREF#28.TP61 NOREF#83.TP56 R66.1 SW1.1 SW1.2
$1N156292: NOREF#20.TP58 NOREF#50.TP62 R65.1 SW2.1 SW2.2
$1N157433: NOREF#10.TP57 NOREF#52.TP63 R64.1 SW3.1 SW3.2
$1N176679: C37.2 C41.1 R53.2 R54.1
$1N236262: R71.2 U3.1 U3.2
$1N410667: NOREF#73.TP16 U11.3 U12.3
$1N418401: R72.1 U3.6 U3.7
$1N487783: C52.1 D3.2 D4.1 NOREF#14.TP53 NOREF#37.TP54 NOREF#82.TP52 R8.1 R9.2 R26.1 R27.2 R71.1 R72.2
$1N488293: R8.2 U4.1 U4.2
$1N488294: R9.1 U4.6 U4.7
$1N489967: C51.2 C52.2
$1N490575: L1.4 L2.1
$1N490975: C51.1 L2.4
$1N492294: L1.3 L2.3 L3.2
$1N493134: C69.2 L1.2 L2.2 U14.1 U15.1 U16.1
$1N503194: C66.1 R101.1 R105.1
$1N503385: C67.1 R102.1 R106.1
$1N503576: C68.1 R103.1 R107.1
$1N503767: C69.1 R104.1 R108.1
$1N508473: NOREF#40.TP44 Q6.2 Q10.1 R104.2 U12.5
$1N509067: NOREF#25.TP47 Q5.2 Q9.1 R103.2 U12.14
$1N511278: NOREF#16.TP15 U11.5 U12.13
$1N527273: NOREF#29.TP42 R85.1 U11.1 U11.2
$1N529939: R18.2 R19.1 R20.1 U5.6
$1N568131: R26.2 U7.1 U7.2
$1N568132: R27.1 U7.6 U7.7
$1N576878: L3.1 L4.2
$1N578962: L4.1 L7.2
$1N579100: L5.2 L7.1
$1N579238: L5.1 L6.2
$1N591038: C49.2 R11.1 R12.2 U8.5
$1N593180: R10.2 U8.7
$1N605976: R95.1 R96.2 U13.5
$1N607717: R23.1 R24.2 U13.12
$1N608651: R13.1 R22.2 U13.2
$1N614433: R85.2 R86.1 U6.3
$1N630548: NOREF#18.TP45 Q3.2 Q7.1 R101.2 U12.12
$1N630554: NOREF#46.TP46 Q4.2 Q8.1 R102.2 U12.1
$1N641847: NOREF#48.3 U2.20
$1N694579: C78.2 C79.2 L6.1
$1N714049: Q11.3 Q12.3
$1N714635: Q12.1 U17.3
$1N714783: Q11.1 U17.1
$1N715797: C75.1 U17.6
$1N716096: R109.2 U17.2
$1N717039: C75.2 R110.2 U17.5
$1N730779: NOREF#12.TP6 NOREF#30.TP5 NOREF#45.TP6 R19.2 R111.1 U5.7 U18.1
$1N731545: R111.2 R112.1 U18.3
$1N733181: NOREF#6.TP2 U8.3 U18.4
$1N733646: R113.2 R115.1 R119.2 U8.2
$1N780071: R25.2 R29.2 R30.2 U6.6
$1N780227: NOREF#61.TP3 U6.5 U13.4
$1N793383: NOREF#77.TP1 R13.2 R30.1 U6.7 U13.1
$1N794152: NOREF#36.TP4 R84.2 R95.2 U6.1 U13.3
$1N840106: R15.2 R23.2 U5.1 U13.13
$1N841757: R14.2 R15.1 R16.2 U5.2
$1N856679: U5.5 U13.14
$1N857948: U5.3 U13.15

Pads without a net: NOREF 13; NOREF#9 2; NOREF#11 1; NOREF#22 5; NOREF#23 16; NOREF#26 18; NOREF#39 2; NOREF#54 9; NOREF#57 1; NOREF#64 17; NOREF#68 10; NOREF#80 4; Q3 3; Q4 3; Q5 3; Q6 3; Q7 3; Q8 3; Q9 3; Q10 3; U2 2 3 4 11 19 21 22 43; U12 2 4 11 15; U17 4; USB1 A6 A7 A8 B6 B7 B8

## Via types
v1: diameter 0.61, hole 0.305, Top Layer to Bottom Layer, 116 vias
v2: diameter 0.5, hole 0.305, Top Layer to Bottom Layer, 20 vias
v3: diameter 1.5, hole 1, Top Layer to Bottom Layer, 1 via
v4: diameter 0.8, hole 0.5, Top Layer to Bottom Layer, 1 via
v5: diameter 1.2, hole 0.8, Top Layer to Bottom Layer, 1 via

## Routing (per net, layer and track width the routed paths; a pad name or vN(x,y) marks a point on that pad's centre or on a via; arc(x,y) is an arc through that point)
+1.65V: length 213.1
  Top Layer w0.254: U8.6 53.54,89.49 52.7,90.33 R10.1 ; R112.2 71.9,95.21 ; C16.2 52.69,92.82 ; R29.1 96.08,71.79
  Top Layer w0.5: R14.1 84.55,96.28 ; 58.88,96.28 58.88,93.67 R113.1 ; R24.1 74.64,81.1 74.64,96.14 74.5,96.28 ; NOREF#78.TP41 89.33,68.64 R86.2 ; 81.29,95.76 81.81,96.28 ; 51.42,91.76 51.83,91.35 R10.1 ; R18.1 77.78,96.28 ; 93.67,83.33 NOREF#24.TP23 ; R22.1 NOREF#66.TP26
  Top Layer w0.8: 96.28,36.86 97.04,36.09 97.04,35.92 C56.2 ; D5.1 96.18,36.96
  Top Layer w1: NOREF#24.TP23 NOREF#5.TP24 98.61,83.33 98.77,83.49 ; NOREF#66.TP26 NOREF#13.TP25 98.66,79.06
  Top Layer w1.5: 98.77,74.67 98.72,74.72 ; 94.38,68.19 C19.1 ; 98.77,71.82 96.08,71.79 ; 52.69,92.82 51.42,92.82 51.42,91.76
  Top Layer w2: 98.77,68.19 98.77,37.01 D6.2 ; 98.77,68.19 98.77,83.49 98.7,83.55 98.7,89.89 94.91,93.69 NOREF#8.TP29 90.39,93.69 87.79,96.28 71.91,96.28 ; 98.77,68.19 94.38,68.19 94.33,68.24 NOREF#78.TP41 ; 71.91,96.28 52.69,96.28 51.42,95.01 51.42,92.82 ; 71.91,96.28 72.04,96.14 72.03,95.35 71.9,95.21 ; 96.18,36.96 96.28,36.86 96.28,32.17 93.96,29.85 R106.2 88.25,30.08 R105.2 77.81,30.1 R108.2 69.18,29.98 R107.2
+3.3V: length 243.3
  Top Layer w0.254: U18.5 67.4,91.61 67.02,91.22 67.02,90.13 NOREF#43.TP14 66.81,89.73 66.81,89.06 66.12,88.36 C77.1 66.62,87.24 v1(67.02,87.24) 67.02,85.51 64.33,82.82 56.25,82.82 55.21,83.86 R11.2 ; C29.1 57.52,76.3 57.52,74.69 56.48,73.65 U2.9 50.44,73.65 49.22,72.42 ; v1(75.65,79.42) 75.65,75.61 79.16,72.1 ; 55.66,68.36 54.36,69.65 U2.1 52,69.65 52,69.64 ; 49.22,72.42 46.39,75.25 U2.24 45.33,77.79 ; 49.22,72.42 51.93,69.71 ; U12.16 80.53,53.3 79.73,52.5 C9.1 ; 52.18,63.28 52.13,63.28 U1.6 ; 52.18,63.28 C35.2 53.3,64.4 53.3,66.5 53.76,66.96 ; 52.18,63.28 52.16,63.25 ; v1(68.49,87.24) 73.37,87.24 v1(73.67,87.54) ; U8.8 55.42,88.03 ; NOREF#59.TP32 C13.2 ; 52,69.64 51.93,69.58 51.93,69.71 ; 52,69.64 53.49,68.15 ; 52,69.64 51.93,69.71 ; 64.02,62.39 64.02,63.21 59.75,67.47 57.37,67.47 56.62,68.23 55.79,68.23 ; U6.8 89.52,74.13 ; v1(75.71,87.19) 76.41,87.19 76.77,86.83 75.55,85.61 v1(75.55,82.27) ; C10.1 89.27,76.36 88.41,77.13 v1(85.56,77.94) ; 54.5,67.69 54.04,68.15 53.49,68.15 ; 53.49,68.15 U2.48 ; U13.16 81.09,78.04 ; C3.1 81.6,59.59 81.6,60.52 82.49,61.41 U11.8 ; 79.96,89.82 79.97,89.12
  Top Layer w0.5: 78.25,55.54 73.93,55.54 67.07,62.39 64.02,62.39 ; 78.25,55.54 78.25,55.13 v1(77.43,54.32) ; 78.25,55.54 v1(78.25,56.3) ; C8.2 C7.2 45.76,87.56 LDO2.2 43.99,83.7 45.33,82.36 ; 78.45,62.37 81.41,59.42 C3.1 ; 78.45,62.37 v1(78.45,58.84) ; 78.45,62.37 C15.1 79.26,65.22 79.26,72 79.16,72.1 79.16,72.76 80.78,74.38 80.78,76.22 80.98,76.42 80.98,77.28 ; C2.2 45.85,82.88 45.33,82.36 ; 80.98,77.28 80.98,77.93 81.09,78.04 v1(82.56,78.04) ; 80.98,77.28 C12.1 ; 45.33,82.36 45.33,77.79 ; Q6.1 80.78,43.9 v1(77.99,43.9) ; Q5.1 v1(70.65,44.28) 70.68,44.26 ; 55.66,68.36 55.16,68.36 53.76,66.96 ; Q3.1 79.73,49.73 C9.1 79.02,52.34 v1(78.8,52.34) ; v4(55.79,69.1) 55.79,68.23
  Top Layer w0.8: Q4.1 92.74,44.16 D5.2 ; C13.2 79.97,89.12 ; 55.23,87.85 55.21,87.82 R11.2 55.19,85.61 C14.1 ; C10.1 89.52,74.13
  Bottom Layer w0.254: v1(82.56,78.04) v1(85.56,77.94) ; v1(75.55,82.27) 75.55,79.52 v1(75.65,79.42) ; v1(75.71,87.19) 75.35,87.54 v1(73.67,87.54) ; v1(68.49,87.24) v1(67.02,87.24)
  Bottom Layer w0.5: Q6.1 88.46,44.18 Q4.1 ; v1(78.25,56.3) 78.45,56.5 v1(78.45,58.84) ; v1(70.65,44.28) 73.72,44.28 Q3.1 77.89,44.01 v1(77.99,43.9) ; v1(77.43,54.32) v1(78.8,52.34)
  vias: v2(52.13,57.16) v2(52.13,56.55)
GND: length 108.7
  Top Layer w0.254: v1(98.41,32.22) 98.11,32.53 98.11,33.15 C56.1 ; 53.54,62.48 53.54,62.71 ; 53.54,62.48 53.54,61.32 v1(53.35,61.12) 53.13,60.9 U1.7 ; 53.54,62.48 53.75,62.68 C35.1 ; 10.58,63.56 10.49,63.65 ; v1(89.62,58.03) 89.22,57.87 U12.8 ; 55.79,66.83 v1(55.84,65.95) ; U5.4 85.57,91.77 v1(85.66,91.86) ; C13.1 v1(80.78,86.37) ; U12.7 v1(89.68,57.26) ; 45.99,85.93 45.57,85.51 v1(45.07,85.51) ; U8.4 60.02,90.75 v1(60.06,90.79) ; 48.22,85.93 48.22,85.61 v1(48.73,85.1) ; R62.2 v1(40.86,96.38) ; v1(70.83,91.61) U18.2 ; v1(88.46,83.78) 88.46,84.49 v1(88.41,84.54) 87.84,83.97 U13.8 ; v1(88.46,83.78) 88,83.33 U13.7 ; v1(88.46,83.78) 88.46,83.38 87.75,82.67 U13.6 ; R109.1 v1(36.59,94.14) ; v1(48.22,83.93) C2.1 ; v1(63.11,92.93) R119.1 ; U2.8 51.97,73.15 v1(51.47,72.66) ; 87.52,63.36 v1(88.66,63.36) ; v1(48.73,70.78) 49.85,70.78 50.31,70.32 50.31,70.27 51.39,69.19 U2.47 ; C14.2 52.09,86.62 v1(52.08,86.63) ; C6.1 v1(39.99,86.68) ; U2.23 46.89,75.72 47.87,74.74 48.17,74.74 v1(48.32,74.89) ; v1(59.3,75.55) C28.2 ; v1(59.96,77.18) C29.2 ; R25.1 v1(95.26,75.15) ; v1(12.41,88.12) v1(12.32,90) ; R20.2 82.16,94.2 v1(82.36,94.4) ; 50.63,63.18 50.74,63.18 v1(50.86,63.06) ; v1(65.95,90.49) C77.2 ; C16.1 v1(54.98,93.94) ; 53.76,65.56 v1(54.47,64.83) ; v1(87.39,75.15) C10.2 ; 10.12,63.65 U4.4 ; U6.4 v1(84.14,69.76) ; C12.2 v1(77.48,77.28) ; U12.6 v1(89.68,56.5) ; R16.1 v1(87.9,93.84)
  Top Layer w0.4: U7.4 22.62,63.71 v1(22.62,62.39) ; v1(17.03,63.67) 16.99,63.7 U3.4 ; v1(19.11,66.97) 19.1,66.98 C18.2 ; C11.2 12.06,66.87 v1(13.02,66.87)
  Top Layer w0.5: C4.1 USB1.EP ; v1(6.01,64.48) 6.01,65.3 C1.2 ; v1(68.64,69.66) 68.59,69.71 C26.1 ; 10.58,63.65 10.12,63.65 ; v1(29.43,60.87) 29.44,60.88 C46.1 ; v1(68.8,74.64) 67.97,74.64 C27.1 ; v3(42.07,86.37) 42.09,86.39 LDO2.1 ; v1(28.66,65.6) 28.83,65.6 C40.1 ; v1(10.63,63.51) 10.58,63.56 ; v1(28.61,73.37) 29.27,74.03 C37.1 ; v1(17.18,83.83) 17.95,83.83 R3.1 U10.1 ; C38.1 29.44,70.99 v1(28.72,70.27) ; v1(21.09,85.76) 21.17,85.84 U10.3 21.17,89.34 NOREF#55.1 22.2,89.98 C5.1 ; C49.1 62.28,83.95 v1(62.4,83.83) ; R12.1 59.8,84.25 v1(60.01,84.04) ; Q1.2 12.75,79.75 v1(12.81,79.82) ; v1(28.72,67.37) 29.44,68.1 C39.1
  Top Layer w1: L1.1 3.17,51.19 D3.1 ; SW4.4 SW4.3 ; SW1.4 SW1.3
  Top Layer w2: USB1.EP 6.84,84.67 ; USB1.EP 6.89,93.35
  vias: v1(32.15,97.89) v1(47.21,72.66) v1(47.21,71.18) v1(47.71,70.37) v1(47.87,71.95) v1(49.54,74.54) v1(50.51,72.45) v1(50.71,74.74) v1(51.37,71.74) v1(60,58.99) v1(81.13,51.63) v1(82.82,59.45) v1(84.14,70.47) v2(47.1,57.16) v2(47.1,56.55) v2(53.15,57.16) v2(53.15,56.55)
VCC: length 56.7
  Top Layer w0.5: C4.2 14.82,84.24 ; 14.82,84.24 13.95,86.65 ; 14.82,84.24 15.61,82.06 22.42,82.16 U10.4 ; LED1.1 10,91.43 ; 10,91.43 LED2.1 ; 10,91.43 13.95,91.42 ; 10,91.43 USB1.A4B9 ; U10.8 13.95,91.42 ; 13.95,91.42 13.95,86.65 ; 13.95,86.65 USB1.B4A9
VDD: length 85.2
  Top Layer w0.4: U4.8 7.56,68.25 C1.1 6.06,67.88 v1(5.8,68.14) ; D4.2 6.93,73.42 12.07,73.42 ; v1(18.25,70.62) C18.1 20.6,68.38 U7.8 ; 12.07,73.42 v1(12.07,72.73) 12.05,72.71 ; 12.07,73.42 17.49,73.42 ; C6.2 37.8,88.85 35.12,86.17 29.88,86.17 27.85,84.14 27.85,79.06 22.21,73.42 17.49,73.42 ; U3.8 14.35,68.28 C11.1 v1(12.05,70.52) ; 17.49,73.42 v1(18.25,72.66)
  Top Layer w0.5: D4.2 2.17,71.36 Q2.3 ; LDO2.3 42.82,89.78 41.47,89.78 40.54,88.85 C6.2 39.94,91.5 R61.1
  Bottom Layer w0.4: v1(12.05,70.52) 12.07,70.54 v1(12.07,72.73) ; v1(18.25,70.62) v1(18.25,72.66) ; v1(5.8,68.14) 3.94,70 D4.2
(no net): length 44.4
  Top Layer w0.254: U2.11 52.42,74.65 52.08,74.99 52.08,75.3 53,76.21 53.25,76.21 ; 46.65,80.48 47.89,79.24 U2.21 ; U12.2 89.94,53.95 NOREF#9.2 ; 80.18,55.84 80.89,56.55 U12.11 ; NOREF#11.1 90,55.27 U12.4 ; U12.15 80.06,53.95 80.02,53.91 ; U2.19 48.89,80.59 49.39,81.09 ; NOREF#64.17 56.83,70.65 U2.3 ; NOREF#26.18 57.42,71.15 U2.4 ; U2.22 47.39,77.51 46.65,78.25 46.65,78.91 ; U2.2 55.96,70.15 57.31,68.8 57.72,68.8 NOREF#23.16 ; U2.43 49.39,65.96 49.69,65.65
BT+: length 52.3
  Top Layer w0.5: NOREF#58.1 R110.1 ; NOREF#58.1 24.6,96.53 C5.2 25.42,93.78 26.58,92.62 26.58,83.83 23.03,80.28 14.75,80.28 13.37,81.65 8.45,81.65 7.18,80.38 R6.2 7.13,79.65 Q2.2 ; NOREF#58.1 U10.5
BT-: length 56.7
  Top Layer w1: NOREF#81.1 89.42,98.72 38.77,98.67 37.76,97.95 Q11.2
BT_DIANYA: length 27.4
  Top Layer w0.254: R62.1 41.88,94.65 45.48,94.65 50.41,89.73 50.41,80.78 49.39,79.76 U2.18
  Top Layer w0.5: R61.2 41.56,94.45 R62.1
HC: length 69.4
  Bottom Layer w1: C78.1 H15.1 C79.1
HP: length 4.5
  Bottom Layer w1: H14.1 78.75,5.8 C66.2
LC: length 60.4
  Top Layer w0.5: C68.2 37.35,9.26 H12.1
  Bottom Layer w2: H12.1 U14.2 21.15,6.75 U16.2
LP: length 4.6
  Bottom Layer w1: H13.1 88.25,9.21 C67.2
PA0_ADC: length 8
  Top Layer w0.254: 55.99,75.09 55.05,74.15 U2.10 ; 64.22,86.12 R115.2 62.54,86.98 61.84,86.98 60.63,88.19 U8.1
PA2_4052_S0_10: length 45.2
  Top Layer w0.254: U2.12 54.22,75.15 57.01,77.94 67.12,77.94 70.93,74.13 70.93,63.26 76.97,57.21 82.45,57.21 U12.10
PA3_4052_S1_9: length 46.3
  Top Layer w0.254: U12.9 77.61,57.85 71.84,63.61 71.84,74.28 67.47,78.65 56.55,78.65 55.08,77.18 52.41,77.18 U2.13
PA4_RS2253_C: length 34.3
  Top Layer w0.254: v1(76.31,83.63) 77.27,82.67 U13.11 ; U2.14 51.39,77.75 51.73,78.09 54.88,78.09 56.1,79.31 67.07,79.31 NOREF#69.TP4 72.05,84.29 v1(73.67,84.29)
  Bottom Layer w0.254: v1(76.31,83.63) 75.65,84.29 v1(73.67,84.29)
PA5_RS2253_B: length 35.8
  Top Layer w0.254: v1(76.67,84.54) 77.89,83.33 U13.10 ; U2.15 50.89,78.06 51.57,78.75 54.47,78.75 55.89,80.17 66.66,80.17 NOREF#35.TP3 71.9,85.41 73.72,85.41 v1(73.67,85.36)
  Bottom Layer w0.254: v1(76.67,84.54) 75.86,85.36 v1(73.67,85.36)
PA6_RS2253_A: length 36.9
  Top Layer w0.254: v1(77.08,85.41) 78.51,83.97 U13.9 ; U2.16 50.39,78.43 51.52,79.57 54.22,79.57 55.64,80.99 65.95,80.99 71.34,86.37 v1(73.62,86.37)
  Bottom Layer w0.254: v1(73.62,86.37) 76.11,86.37 v1(77.08,85.41)
PA7_SMG3175: length 28.8
  Top Layer w0.254: U18.6 68,89.23 67.75,88.97 67.75,84.87 64.73,81.85 55.33,81.85 53.76,80.28 51.27,80.28 49.89,78.89 U2.17
PA13_SWDIO: length 6.9
  Top Layer w0.254: U2.34 45.91,70.65 46.19,70.37 46.19,69.41 44.82,68.03 H3.3
PA14_SWCLK: length 5.8
  Top Layer w0.254: U2.37 46.39,64.52 H3.2
PA15_RST: length 10.9
  Top Layer w0.254: U1.2 48.13,60.96 46.89,62.21 U2.38
  vias: v2(48.12,57.16) v2(48.12,56.55)
PB3_SPI1_SCK: length 11.7
  Top Layer w0.254: v1(50.1,60.57) 50.1,57.83 U1.4 ; U2.39 47.39,62.88 v1(48.22,62.04)
  Bottom Layer w0.254: v1(50.1,60.57) 48.63,62.04 v1(48.22,62.04)
  vias: v2(50.15,57.16) v2(50.15,56.55)
PB4_RS: length 10.9
  Top Layer w0.254: U1.3 49.13,62.3 47.89,63.54 U2.40
  vias: v2(49.14,57.11) v2(49.14,56.55)
PB5_SPI1_MOSI: length 11.5
  Top Layer w0.254: U1.5 51.17,57.84 51.17,60.67 50.15,61.68 50.15,62.29 48.39,64.06 U2.41
  vias: v2(51.12,57.16) v2(51.12,56.55)
PB8_GUANJI: length 5.4
  Top Layer w0.254: v5(17.69,78.35) 16.87,78.41 R7.1 ; NOREF#51.11 51.68,65.6 50.39,66.89 U2.45
PB9_LCD_BEIGUANG: length 4.1
  Top Layer w0.254: 56.96,65.29 57.11,65.44 R51.2 ; NOREF#33.12 52.08,66.46 51.68,66.46 50.89,67.25 U2.46
PB12_KAIJI: length 5
  Top Layer w0.254: R67.1 35.13,84.09 D2.2
SIN: length 48.2
  Top Layer w0.254: U4.3 9.28,65.72 9.92,66.36 9.92,68.24 U4.5 ; U3.3 15.68,65.51 15.89,65.72 16.33,66.16 U3.5 ; U7.3 21.93,66.23 22.58,66.88 U7.5 ; 35.72,62.19 36.39,59.96 R58.1 R59.1
  Top Layer w0.5: 9.29,65.72 22.79,65.72 NOREF#56.TP51 25.06,63.46 30.04,63.46 30.84,62.66 C46.2 32.66,62.56 35.72,62.19
$1N5478: length 4.4
  Top Layer w0.254: R1.1 7.91,90.3 USB1.A5
$1N5501: length 4.6
  Top Layer w0.254: USB1.B5 8.87,87.26 R2.2
$1N5982: length 3.4
  Top Layer w0.5: U10.2 19.88,85.15 R3.2
$1N6392: length 3.1
  Top Layer w0.5: LED1.2 R4.2
$1N6468: length 11.5
  Top Layer w0.5: LED2.2 11.75,99.28 18.76,99.28 R5.2
$1N6485: length 4
  Top Layer w0.5: U10.7 19.88,93.94 R4.1
$1N7176: length 3.9
  Top Layer w0.5: R5.1 21.2,94.2 U10.6
$1N9972: length 8.5
  Top Layer w0.5: Q2.1 6.83,77.75 R6.1 7.7,77.58 7.7,76.87 ; Q1.3 7.7,76.87 ; 7.7,76.87 D1.2
$1N10161: length 3
  Top Layer w0.5: R7.2 13.7,77.85 Q1.1
$1N32954: length 4.6
  Top Layer w0.254: R83.2 81.55,70.26 R84.1 81.59,71.84 82.51,71.84 83.04,72.37 U6.2
$1N33172: length 9.6
  Top Layer w0.254: U11.6 81.94,62.71 81.94,62.53 ; R83.1 82.56,67.74 NOREF#72.TP19 82.56,64.78 81.6,63.82 81.6,62.87 81.94,62.53 ; 81.94,62.53 81.94,62.3 82.19,62.06 U11.7
$1N55108: length 13.7
  Top Layer w0.254: 58.94,70.78 58.07,71.65 U2.5
  Top Layer w0.5: 58.94,70.78 61.32,70.78 X1.1
  Top Layer w0.8: C26.2 66.31,69.7 X1.1
$1N55316: length 14.2
  Top Layer w0.254: U2.6 59.09,72.15 59.14,72.1
  Top Layer w0.5: 59.14,72.1 59.89,72.1 X1.2
  Top Layer w0.8: X1.2 66.43,74.6 66.52,74.69
$1N56684: length 5.7
  Top Layer w0.254: U2.7 58.06,72.65 58.79,73.38
$1N65263: length 6
  Top Layer w0.254: C33.2 55.85,62.41 54.13,60.68 U1.8
  vias: v2(54.12,57.16) v2(54.12,56.55)
$1N65484: length 6.2
  Top Layer w0.254: C33.1 57.25,62.28 55.13,60.16 U1.9
  vias: v2(55.13,57.16) v2(55.13,56.55)
$1N65778: length 3
  Top Layer w0.254: U1.10 57.32,58.99 C34.2
  vias: v2(56.15,57.11) v2(56.15,56.55)
$1N76678: length 3.8
  Top Layer w0.254: LED3.2 61.48,63.71 R51.1
$1N79731: length 14.2
  Top Layer w0.254: NOREF#4.TP17 38.01,77.38 42.24,73.15 U2.29
  Top Layer w0.5: R53.1 NOREF#4.TP17
$1N83028: length 6.2
  Top Layer w0.5: 32.66,71.71 32.66,71.05 ; 32.66,71.05 C38.2 ; 32.66,71.05 C42.1 ; 32.66,71.05 R55.1
$1N83269: length 6.3
  Top Layer w0.5: C43.1 32.66,67.98 ; 32.66,67.98 R56.1 ; 32.66,67.98 32.66,68.66 ; 32.66,67.98 C39.2
$1N83512: length 6.5
  Top Layer w0.5: 32.66,65 R57.1 ; 32.66,65 R56.2 ; 32.66,65 C40.2 ; 32.66,65 C44.1
$1N86336: length 8.9
  Top Layer w0.254: U2.30 39.95,72.65 NOREF#32.TP8
  Top Layer w0.5: C41.2 37.81,74.79 NOREF#32.TP8
$1N86592: length 8.5
  Top Layer w0.254: NOREF#3.TP9 38.98,71.18 40.65,71.18 41.62,72.15 U2.31
  Top Layer w0.5: NOREF#3.TP9 C42.2
$1N86848: length 9.6
  Top Layer w0.254: NOREF#79.TP10 38.98,68.49 42.14,71.65 U2.32
  Top Layer w0.5: NOREF#79.TP10 C43.2
$1N87104: length 12.1
  Top Layer w0.254: U2.33 42.76,71.15 40.4,68.8 40.4,66.15 NOREF#63.TP11
  Top Layer w0.5: NOREF#63.TP11 38.72,64.48 C44.2
$1N87360: length 13.5
  Top Layer w0.254: U2.35 43.08,70.15 41.21,68.29 41.21,64.17 NOREF#70.TP12
  Top Layer w0.5: NOREF#70.TP12 39.23,62.19 C45.2
$1N88068: length 12.9
  Top Layer w0.254: U2.36 43.9,69.65 42.07,67.83 42.07,63.41 41.77,63.11 41.77,62.95
  Top Layer w0.5: R58.2 38.82,60 41.77,62.95
$1N90333: length 6.2
  Top Layer w0.254: U2.42 48.89,65.24 NOREF#53.14 ; R59.2 40.65,58.03 NOREF#15.15
$1N104798: length 4.7
  Top Layer w0.254: U2.44 49.89,66.62 50.56,65.95 50.56,64.68 R63.2
$1N112001: length 14.8
  Top Layer w0.254: U2.25 44.89,76.4 44.16,77.13 44.16,80.12 43.09,81.19 43.09,82.06 NOREF#38.TP22
  Top Layer w0.5: NOREF#38.TP22 40.81,84.34 R67.2
$1N112276: length 13.7
  Top Layer w0.254: U2.26 43.94,74.65 43.29,75.3 43.29,79.46 NOREF#75.TP21
  Top Layer w0.5: NOREF#75.TP21 40.15,82.61 R66.2
$1N112550: length 12.2
  Top Layer w0.254: NOREF#44.TP20 42.43,77.84 42.43,75.35 43.63,74.15 U2.27
  Top Layer w0.5: R65.2 39.43,80.84 NOREF#44.TP20
$1N112826: length 10.8
  Top Layer w0.254: NOREF#60.TP19 41.72,76.21 41.72,75.35 43.42,73.65 U2.28
  Top Layer w0.5: NOREF#60.TP19 38.77,79.16 R64.2
$1N150454: length 39.9
  Top Layer w0.254: v1(23.38,72.56) 23.84,72.1 23.84,66.41 v1(24.3,65.95) ; v1(23.84,63.06) 23.74,62.95 23.74,58.99 27.74,54.99 SW4.2
  Top Layer w0.5: D2.1 24.7,77.99 v1(21.7,74.99) 16.36,74.99 D1.1
  Top Layer w1: SW4.1 SW4.2
  Bottom Layer w0.254: v1(23.84,63.06) v1(24.3,65.95) ; v1(23.38,72.56) v1(21.7,74.99)
$1N155250: length 48
  Top Layer w0.254: v1(25.41,64.88) 25.62,65.09 25.62,75.35 32.93,82.66 32.98,82.61 R66.1 ; v1(25.01,62.55) NOREF#28.TP61 25.01,59.6 29.38,55.23 34.98,55.23 36.29,53.92
  Top Layer w1: 36.29,53.92 SW1.2 SW1.1
  Bottom Layer w0.254: v1(25.01,62.55) v1(25.41,64.88)
$1N156292: length 72.9
  Top Layer w0.254: R65.1 32.17,80.84 26.38,75.04 26.38,65.04 26.63,64.78 26.63,64.63 ; v1(26.38,62.34) 26.28,62.24 26.28,59.55 29.73,56.1 35.22,56.1 35.72,55.59 43.04,55.59 43.6,55.03 43.6,52.84 44.72,51.73 59.21,51.73 SW2.2
  Top Layer w1: SW2.1 SW2.2
  Bottom Layer w0.254: v1(26.38,62.34) v1(26.58,64.53)
$1N157433: length 78.3
  Top Layer w0.254: v1(27.85,64.58) 27.55,64.88 27.55,74.99 31.71,79.16 R64.1 ; v1(27.65,62.29) 27.65,60.47 NOREF#52.TP63 31.1,57.01 35.93,57.01 36.54,56.4 44.01,56.4 44.67,55.74 44.67,53.25 45.33,52.59 57.42,52.59 60.72,55.89 67.19,55.89 SW3.2
  Top Layer w1: SW3.1 SW3.2
  Bottom Layer w0.254: v1(27.65,62.29) v1(27.85,64.58)
$1N176679: length 6.5
  Top Layer w0.5: 32.64,74.16 R54.1 ; 32.64,74.16 R53.2 ; 32.64,74.16 C37.2 ; 32.64,74.16 C41.1
$1N236262: length 3.7
  Top Layer w0.254: U3.2 15.03,62.42 R71.2 14.38,62.19 U3.1
$1N410667: length 10.9
  Top Layer w0.254: 87.52,62.71 86.74,62.71 85.76,61.73 85.76,55.98 87.14,54.6 U12.3
$1N418401: length 4
  Top Layer w0.254: U3.7 15.03,69.8 R72.1 15.68,69.9 U3.6
$1N487783: length 51.6
  Top Layer w0.5: R8.1 8.14,55.07 C52.1 ; R8.1 14.44,60.32 R71.1 NOREF#37.TP54 R26.1 ; R8.1 7.31,59.49 NOREF#82.TP52 D3.2 3.52,59.54 D4.1 4.03,62.51 4.03,67.83 7.83,71.63 R9.2 9.11,71.68 R72.2 R27.2
$1N488293: length 3.9
  Top Layer w0.254: U4.1 7.98,61.99 R8.2 8.63,62.32 U4.2
$1N488294: length 4
  Top Layer w0.254: U4.7 8.63,69.7 R9.1 9.28,69.9 U4.6
$1N489967: length 5.3
  Top Layer w1: C52.2 C51.2
$1N490575: length 6
  Bottom Layer w1: L2.1 16.12,44.55 L1.4
$1N490975: length 11.4
  Top Layer w1: C51.1 23.17,51.1 L2.4
$1N492294: length 31.1
  Bottom Layer w0.8: L3.2 L2.3 arc(22.34,38.5) 20.34,39.33 12.95,39.33 arc(10.98,38.52) L1.3
$1N493134: length 85.1
  Top Layer w0.5: U14.1 41.67,14.44 63.87,12.51 C69.2
  Bottom Layer w2: L1.2 4.58,35.13 U16.1 16.04,29.75 ; 16.04,29.75 21.15,29.75 U14.1 ; 16.04,29.75 16.17,29.88 L2.2
$1N503194: length 7.3
  Top Layer w1: R101.1 80,22.88 R105.1 78.75,21.97 C66.1
$1N503385: length 8.2
  Top Layer w1: R102.1 92.93,22.65 R106.1 88.48,21.22 C67.1
$1N503576: length 7.1
  Top Layer w1: R103.1 64.73,22.78 R107.1 62.7,21.63 C68.1
$1N503767: length 7.3
  Top Layer w1: C69.1 69.76,22.45 R108.1 73.11,22.91 R104.1
$1N508473: length 42.7
  Top Layer w0.254: U12.5 87.24,55.89 v1(86.73,56.15)
  Top Layer w0.5: 84.04,39.51 84.04,42.87 ; 84.04,39.51 Q10.1 ; 84.04,39.51 84.04,33.49 82.92,32.37 79.31,32.37 77.77,33.91 R104.2 ; 84.04,42.87 84.04,47.82 NOREF#40.TP44 86.02,49.8 86.02,54.57 v1(85.92,54.67) ; 84.04,42.87 Q6.2
  Bottom Layer w0.254: v1(85.92,54.67) v1(86.73,56.15)
$1N509067: length 40.2
  Top Layer w0.254: U12.14 80.81,54.6 80.43,54.98 79.57,54.98 77.23,52.64 77.23,50.71 75.2,48.68 NOREF#25.TP47
  Top Layer w0.5: R103.2 70.47,39.02 70.47,39.6 ; NOREF#25.TP47 72,45.28 72,43.6 71.79,43.4 ; 71.79,43.4 71.79,40.92 70.47,39.6 ; 71.79,43.4 71.39,43 Q5.2 ; 70.47,39.6 Q9.1
$1N511278: length 11.1
  Top Layer w0.254: U11.5 83.7,63.36 84.7,62.36 84.7,55.94 84,55.25 U12.13
$1N527273: length 9.8
  Top Layer w0.254: 88.71,61.73 88.38,61.41 87.52,61.41 ; 88.71,61.73 89.52,62.55 89.52,63.67 87.79,65.4 R85.1 ; 88.71,61.73 88.71,62.03 88.68,62.06 87.52,62.06
$1N529939: length 7.8
  Top Layer w0.254: 79.96,91.12 78.73,91.12 77.8,92.05 77.07,92.05 ; R20.1 78.44,94.2 R18.2 77.07,92.82 77.07,92.05 ; 77.07,92.05 R19.1
$1N568131: length 3.8
  Top Layer w0.254: U7.2 21.28,62.47 R26.2 20.63,62.14 U7.1
$1N568132: length 3.9
  Top Layer w0.254: U7.7 21.28,69.8 R27.1 21.93,69.9 U7.6
$1N576878: length 1.5
  Bottom Layer w1: L3.1 40.35,44.24
$1N578962: length 1.6
  Bottom Layer w1: L4.1 44.87,44.24 L7.2
$1N579100: length 1.7
  Bottom Layer w1: L7.1 L5.2
$1N579238: length 1.7
  Bottom Layer w1: L6.2 54.22,44.18 52.57,44.18
$1N591038: length 10.6
  Top Layer w0.254: C49.2 61.07,85.75 R12.2 ; U8.5 56.49,90.14 56.91,89.73 56.91,85.79
  Top Layer w0.5: R11.1 56.87,85.75 R12.2
$1N593180: length 3.6
  Top Layer w0.254: U8.7 51.85,88.84 R10.2
$1N605976: length 5.8
  Top Layer w0.254: R96.2 92.05,83.21 R95.1 89.99,83.12 89.42,83.12 88.32,82.02 U13.5
$1N607717: length 5.3
  Top Layer w0.254: R24.2 76.4,80.93 R23.1 79.19,82.02 U13.12
$1N608651: length 5.7
  Top Layer w0.254: R22.2 92.16,79 R13.1 89.11,80.07 U13.2
$1N614433: length 5.9
  Top Layer w0.254: R85.2 85.56,68.58 R86.1 85.66,71.03 85.51,71.49 85.15,71.69 U6.3
$1N630548: length 37.7
  Top Layer w0.254: v1(83.99,56.2) 83.53,55.89 U12.12
  Top Layer w0.5: 75.43,42.71 75.35,42.79 NOREF#18.TP45 84.8,52.23 v1(84.8,54.83) ; 75.43,42.71 Q3.2 ; 75.43,42.71 75.46,42.68 77.03,42.68 ; 75.43,42.71 77.03,42.68 ; 77.03,39.18 77.03,42.68 ; 77.03,39.18 77.03,37.66 79.62,35.06 81.31,35.06 81.5,34.88 ; 77.03,39.18 Q7.1
  Bottom Layer w0.254: v1(83.99,56.2) v1(84.8,54.83)
$1N630554: length 29.9
  Top Layer w0.254: 88.25,52.64 88.25,53.24 U12.1
  Top Layer w0.5: 86.58,39.46 86.58,42.92 ; 86.58,39.46 86.58,35.72 88.51,33.79 R102.2 ; 86.58,39.46 88.48,39.46 ; 86.58,42.92 86.58,47.41 NOREF#46.TP46 88.25,49.09 88.25,52.64 ; 86.58,42.92 Q4.2
$1N641847: length 5.4
  Top Layer w0.254: 47.61,81.75 47.61,80.94 48.39,80.16 U2.20
$1N694579: length 27.3
  Bottom Layer w1: L6.1 55.94,35.12 C78.2 C79.2
$1N714049: length 3.9
  Top Layer w0.254: Q12.3 Q11.3
$1N714635: length 2.7
  Top Layer w0.5: 31.98,93.26 31.97,94.09 Q12.1
$1N714783: length 3.5
  Top Layer w0.5: U17.1 Q11.1
$1N715797: length 2.1
  Top Layer w0.254: 33.88,90.46 C75.1
$1N716096: length 4.2
  Top Layer w0.254: R109.2 35.33,91.87 35.27,91.81 33.7,91.81 32.93,92.58 U17.2
$1N717039: length 8.3
  Top Layer w0.254: 32.93,90.46 C75.2
  Top Layer w0.5: C75.2 31.31,89.22 R110.2
$1N730779: length 13.4
  Top Layer w0.254: R19.2 77,90.47 79.96,90.47 ; v1(73.52,88.66) R111.1 71.48,88.67 70.68,89.47 70.68,90.17 U18.1
  Top Layer w0.5: 76.26,88.2 76.26,88.25 v1(75.91,88.61) 75.91,89.53 R19.2
  Bottom Layer w0.254: v1(75.91,88.61) v1(73.52,88.66)
$1N731545: length 4.2
  Top Layer w0.254: R111.2 72.2,91.61 R112.1 71.34,92.47 70.57,92.47 70.36,92.25 U18.3
$1N733181: length 8.7
  Top Layer w0.254: U18.4 67.02,92.27 65.14,92.01 61.79,89.88 61.12,89.52 U8.3
$1N733646: length 9.5
  Top Layer w0.254: R115.1 62.31,88.84 U8.2 58.91,88.84 58.48,89.27 58.48,91.56 R113.2 R119.2
$1N780071: length 7.5
  Top Layer w0.254: U6.6 89.83,71.69 R30.2 R29.2 R25.2
$1N780227: length 14.6
  Top Layer w0.254: 86.88,81.17 U13.4 85.54,81.37 84.59,80.43 84.59,77.58 86.53,75.65 86.53,72.7 88.15,71.07 U6.5
$1N793383: length 11.5
  Top Layer w0.254: U6.7 90.18,72.45 R30.1 91.3,76.52 R13.2 89.62,77.79 88.61,78.8 U13.1
$1N794152: length 16.5
  Top Layer w0.254: R95.2 88.76,80.78 U13.3 86.01,80.72 85.66,80.38 ; U6.1 84.04,73.31 R84.2 83.68,75.44 v1(83.68,79.16)
  Bottom Layer w0.254: v1(83.68,79.16) v1(85.41,80.12)
$1N840106: length 17.7
  Top Layer w0.254: v1(84.34,89.22) U5.1 85.91,88.46 R15.2 ; 82.87,88.3 82.77,88.3 v1(82.72,88.25) 82.72,81.82 82.27,81.37 U13.13 80.05,81.37 79.26,80.58 79.26,79.97 78.71,79.42 R23.2
  Bottom Layer w0.254: v1(82.72,88.25) v1(84.34,89.22)
$1N841757: length 9.4
  Top Layer w0.254: R15.1 86.13,90.47 U5.2 83.6,90.47 82.97,91.1 82.97,93.19 R14.2 R16.2
$1N856679: length 15.1
  Top Layer w0.254: U13.14 82.55,80.72 83.73,81.9 83.73,88.35 81.44,90.64 81.44,91.45 81.13,91.77 79.96,91.77
$1N857948: length 18.2
  Top Layer w0.254: U13.15 82.82,80.07 84.95,82.21 84.95,84.59 88.15,87.8 88.15,90.64 87.67,91.12 U5.3

## Copper pours and planes (outline as drawn; the poured copper is in the pictures)
+1.65V on Top Layer: 92.93,68.19 98.77,68.19 98.77,46.83 92.93,46.83
+1.65V on Top Layer: 88.6,94.97 99.58,94.97 99.58,68.08 88.6,68.08
GND on Top Layer: 46.65,73.77 49.95,73.77 49.95,69.81 46.65,69.81
GND on Top Layer: 50.1,73.11 51.91,73.11 51.91,70.83 50.1,70.83
GND on Top Layer: 47.42,75.23 51.52,75.23 51.52,73.57 47.42,73.57
GND on Bottom Layer: 0,100 100,100 100,0 0,0

Small or netless copper shapes (teardrops, artwork), in the pictures only: 1 on Top Layer

## Text on the board
Bottom Silkscreen Layer: LC | HC | HP | LP | 电池+ | 电池- | yjmwxwx-自制电池内阻仪 / 2023-02-13 / 莱州-尹辑明设计
Top Silkscreen Layer: CLK | DIO | GND | LC | HC | HP | LP | 电池+ | 电池-
